# Altium project jetson-tx-baseboard.PrjPcb (part 1 of 2)
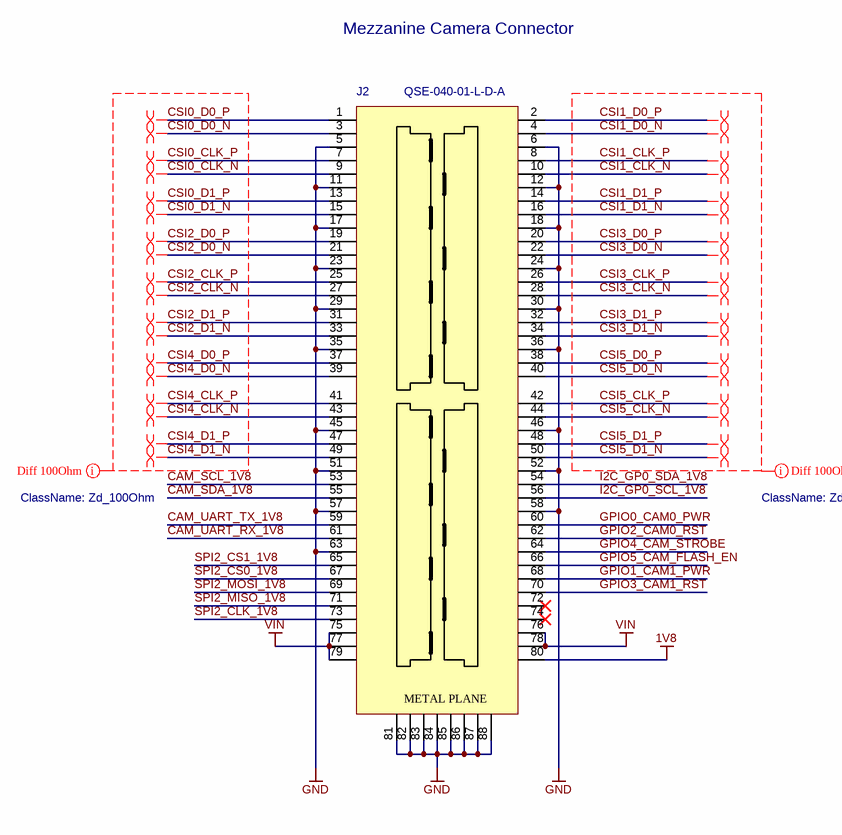
[diagram p0: Camera.SchDoc]
AM_Revision: 2.2.1; AM_Status: OSHW; AM_Title: TX Baseboard
10 sheets, 214 parts. Net scope: global (net labels, ports and power ports of the same name join across sheets).
Board file: PCB.PcbDoc
Sheets:
  Camera.SchDoc
  Ethernet.SchDoc
  HDMI.SchDoc
  ID-Serial.SchDoc
  Misc.SchDoc
  SoM-Interfaces.SchDoc
  SoM-Unused.SchDoc
  Supply.SchDoc
  UART.SchDoc
  USB.SchDoc

## Sheet Camera.SchDoc
size A3; DocumentNumber: 8; SheetNumber: 8; SheetTotal: 10; PageSetup: Record=PageOptions|CenterHorizontal=True|CenterVertical=True|PrintScale=0.97|XCorrection=1.00|YCorrection=1.00|PrintKind=1|BorderSize=5000000|LeftOffset=0|BottomOffset=0|Orientation=2|PaperLength=2970|PaperWidth=2100|Scale=100|PaperSource=7|PrintQuality=600|MediaType=1|DitherType=10|PaperKind=A4|PrintScaleMode=1

### Parts
J2  QSE-040-01-L-D-A  [QSE-040-01-L-D-A]

### Nets
1V8: J2.80
GND: J2.5 J2.6 J2.11 J2.12 J2.17 J2.18 J2.23 J2.24 J2.29 J2.30 J2.35 J2.36 J2.45 J2.46 J2.51 J2.52 J2.57 J2.58 J2.63 J2.81 J2.82 J2.83 J2.84 J2.85 J2.86 J2.87 J2.88
VIN: J2.75 J2.76 J2.77 J2.78 J2.79
CAM_SCL_1V8: J2.53
CAM_SDA_1V8: J2.55
CAM_UART_RX_1V8: J2.61
CAM_UART_TX_1V8: J2.59
CSI0_CLK_N: J2.9
CSI0_CLK_P: J2.7
CSI0_D0_N: J2.3
CSI0_D0_P: J2.1
CSI0_D1_N: J2.15
CSI0_D1_P: J2.13
CSI1_CLK_N: J2.10
CSI1_CLK_P: J2.8
CSI1_D0_N: J2.4
CSI1_D0_P: J2.2
CSI1_D1_N: J2.16
CSI1_D1_P: J2.14
CSI2_CLK_N: J2.27
CSI2_CLK_P: J2.25
CSI2_D0_N: J2.21
CSI2_D0_P: J2.19
CSI2_D1_N: J2.33
CSI2_D1_P: J2.31
CSI3_CLK_N: J2.28
CSI3_CLK_P: J2.26
CSI3_D0_N: J2.22
CSI3_D0_P: J2.20
CSI3_D1_N: J2.34
CSI3_D1_P: J2.32
CSI4_CLK_N: J2.43
CSI4_CLK_P: J2.41
CSI4_D0_N: J2.39
CSI4_D0_P: J2.37
CSI4_D1_N: J2.49
CSI4_D1_P: J2.47
CSI5_CLK_N: J2.44
CSI5_CLK_P: J2.42
CSI5_D0_N: J2.40
CSI5_D0_P: J2.38
CSI5_D1_N: J2.50
CSI5_D1_P: J2.48
GPIO0_CAM0_PWR: J2.60
GPIO1_CAM1_PWR: J2.68
GPIO2_CAM0_RST: J2.62
GPIO3_CAM1_RST: J2.70
GPIO4_CAM_STROBE: J2.64
GPIO5_CAM_FLASH_EN: J2.66
I2C_GP0_SCL_1V8: J2.56
I2C_GP0_SDA_1V8: J2.54
SPI2_CLK_1V8: J2.73
SPI2_CS0_1V8: J2.67
SPI2_CS1_1V8: J2.65
SPI2_MISO_1V8: J2.71
SPI2_MOSI_1V8: J2.69

Not connected (* = marked no-connect by the designer): J2 72* 74*

### Layout directives
differential pair: CSI0_CLK_N, CSI0_CLK_P, CSI0_D0_N, CSI0_D0_P, CSI0_D1_N, CSI0_D1_P, CSI1_CLK_N, CSI1_CLK_P, CSI1_D0_N, CSI1_D0_P, CSI1_D1_N, CSI1_D1_P, CSI2_CLK_N, CSI2_CLK_P, CSI2_D0_N, CSI2_D0_P, CSI2_D1_N, CSI2_D1_P, CSI3_CLK_N, CSI3_CLK_P, CSI3_D0_N, CSI3_D0_P, CSI3_D1_N, CSI3_D1_P, CSI4_CLK_N, CSI4_CLK_P, CSI4_D0_N, CSI4_D0_P, CSI4_D1_N, CSI4_D1_P, CSI5_CLK_N, CSI5_CLK_P, CSI5_D0_N, CSI5_D0_P, CSI5_D1_N, CSI5_D1_P
net class Zd_100Ohm: CSI0_CLK_N, CSI0_CLK_P, CSI0_D0_N, CSI0_D0_P, CSI0_D1_N, CSI0_D1_P, CSI1_CLK_N, CSI1_CLK_P, CSI1_D0_N, CSI1_D0_P, CSI1_D1_N, CSI1_D1_P, CSI2_CLK_N, CSI2_CLK_P, CSI2_D0_N, CSI2_D0_P, CSI2_D1_N, CSI2_D1_P, CSI3_CLK_N, CSI3_CLK_P, CSI3_D0_N, CSI3_D0_P, CSI3_D1_N, CSI3_D1_P, CSI4_CLK_N, CSI4_CLK_P, CSI4_D0_N, CSI4_D0_P, CSI4_D1_N, CSI4_D1_P, CSI5_CLK_N, CSI5_CLK_P, CSI5_D0_N, CSI5_D0_P, CSI5_D1_N, CSI5_D1_P

### Notes on the sheet
- Mezzanine Camera Connector
- Title:
- Size:
- Date:
- A3
- Revision:
- Page:
- of
- Antmicro Ltd.
- File:
- www.antmicro.com
- (in symbol QSE-040-01-L-D-A) METAL PLANE

### Library data of the parts
J2 = QSE-040-01-L-D-A: SAMTEC 	QSE-040-01-L-D-A  Stacking Board Connector, Dual Row, QSE Series, Receptacle, 0.8 mm, 80 Contacts, Surface Mount; Part Number: QSE-040-01-L-D-A; Value: QSE-040-01-L-D-A; Manufacturer: SAMTEC; Part Symbol: QSE-040-01-L-D-A

## Sheet Ethernet.SchDoc
size A3; DocumentNumber: 7; SheetNumber: 7; SheetTotal: 10; PageSetup: Record=PageOptions|CenterHorizontal=True|CenterVertical=True|PrintScale=0.97|XCorrection=1.00|YCorrection=1.00|PrintKind=1|BorderSize=5000000|LeftOffset=0|BottomOffset=0|Orientation=2|PaperLength=2970|PaperWidth=2100|Scale=100|PaperSource=7|PrintQuality=600|MediaType=1|DitherType=10|PaperKind=A4|PrintScaleMode=1
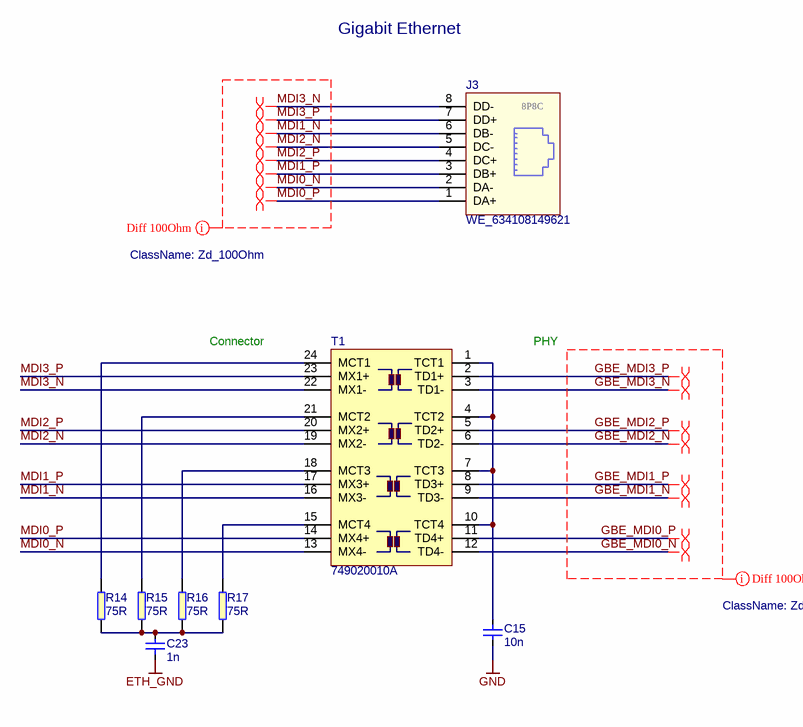
[diagram p1: Ethernet.SchDoc]

### Parts
C15  10n  [1206]
C23  1n  [1206]
J3  WE_634108149621  [WE_634108149621]
R14  75R  [0603]
R15  75R  [0603]
R16  75R  [0603]
R17  75R  [0603]
T1  749020010A  [Wurth-749020010A]

### Nets
ETH_GND: C23.1
GND: C15.2
GBE_MDI0_N: T1.12(TD4-)
GBE_MDI0_P: T1.11(TD4+)
GBE_MDI1_N: T1.9(TD3-)
GBE_MDI1_P: T1.8(TD3+)
GBE_MDI2_N: T1.6(TD2-)
GBE_MDI2_P: T1.5(TD2+)
GBE_MDI3_N: T1.3(TD1-)
GBE_MDI3_P: T1.2(TD1+)
MDI0_N: J3.2(DA-) T1.13(MX4-)
MDI0_P: J3.1(DA+) T1.14(MX4+)
MDI1_N: J3.6(DB-) T1.16(MX3-)
MDI1_P: J3.3(DB+) T1.17(MX3+)
MDI2_N: J3.5(DC-) T1.19(MX2-)
MDI2_P: J3.4(DC+) T1.20(MX2+)
MDI3_N: J3.8(DD-) T1.22(MX1-)
MDI3_P: J3.7(DD+) T1.23(MX1+)
NetC15_1: C15.1 T1.1(TCT1) T1.4(TCT2) T1.7(TCT3) T1.10(TCT4)
NetC23_2: C23.2 R14.1 R15.1 R16.1 R17.1
NetR14_2: R14.2 T1.24(MCT1)
NetR15_2: R15.2 T1.21(MCT2)
NetR16_2: R16.2 T1.18(MCT3)
NetR17_2: R17.2 T1.15(MCT4)

### Layout directives
differential pair: GBE_MDI0_N, GBE_MDI0_P, GBE_MDI1_N, GBE_MDI1_P, GBE_MDI2_N, GBE_MDI2_P, GBE_MDI3_N, GBE_MDI3_P, MDI0_N, MDI0_P, MDI1_N, MDI1_P, MDI2_N, MDI2_P, MDI3_N, MDI3_P
net class Zd_100Ohm: GBE_MDI0_N, GBE_MDI0_P, GBE_MDI1_N, GBE_MDI1_P, GBE_MDI2_N, GBE_MDI2_P, GBE_MDI3_N, GBE_MDI3_P, MDI0_N, MDI0_P, MDI1_N, MDI1_P, MDI2_N, MDI2_P, MDI3_N, MDI3_P

### Notes on the sheet
- Gigabit Ethernet
- Connector
- PHY
- Title:
- Size:
- Date:
- A3
- Revision:
- Page:
- of
- Antmicro Ltd.
- File:
- www.antmicro.com
- (in symbol WE_634108149621) 8P8C

### Library data of the parts
C15 = C_10n_1206: MLCC SMT Capacitor 10nF 1206; Manufacturer: MULTICOMP; Part Symbol: MC1206B103K631CT; Value: 10n; Part Number: C_10n_1206
C23 = C_1n_1206: MLCC SMT Capacitor 1nF 1206; Manufacturer: AVX; Part Symbol: 12061A102JAT2A; Value: 1n; Part Number: C_1n_1206
J3 = WE_634108149621: Modular Connectors / Ethernet Connectors WR-MJ Mod Jk 8P8C Solder Tab w/Mylar; Manufacturer: WURTH ELEKTRONIK; Part Number: WE_634108149621; Value: WE_634108149621; Part Symbol: 634108149621
R14-R17 = R_75R_0603: SMT Resistor 75R 0603; Manufacturer: MULTICOMP; Part Symbol: MCWR06X75R0FTL; Value: 75R; Part Number: R_75R_0603
T1 = Wurth-749020010A: LAN TRANSFORMER, 10/100/1000 BASE-T; Manufacturer: WURTH ELEKTRONIK; Part Number: Wurth-749020010A; Value: 749020010A; Part Symbol: 749020010A

## Sheet HDMI.SchDoc
size A3; DocumentNumber: 6; SheetNumber: 6; SheetTotal: 10; PageSetup: Record=PageOptions|CenterHorizontal=True|CenterVertical=True|PrintScale=0.97|XCorrection=1.00|YCorrection=1.00|PrintKind=1|BorderSize=5000000|LeftOffset=0|BottomOffset=0|Orientation=2|PaperLength=2970|PaperWidth=2100|Scale=100|PaperSource=7|PrintQuality=600|MediaType=1|DitherType=10|PaperKind=A4|PrintScaleMode=1
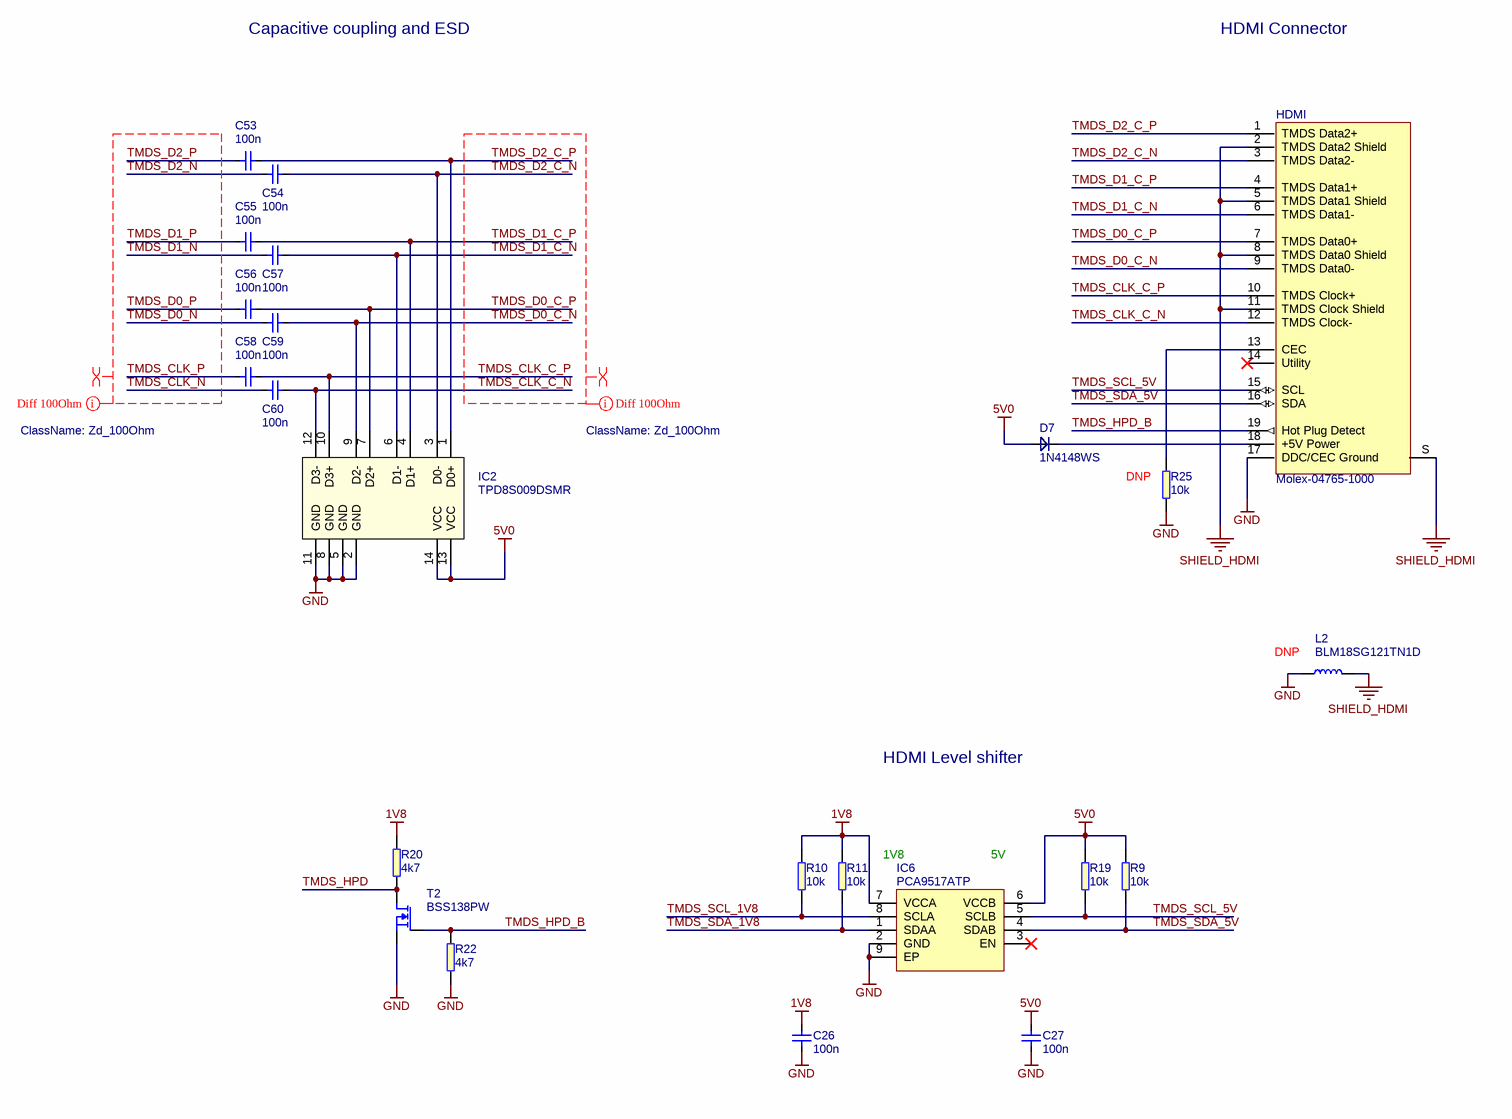
[diagram p2: HDMI.SchDoc]

### Parts
C26  100n  [0603]
C27  100n  [0603]
C53  100n  [0402]
C54  100n  [0402]
C55  100n  [0402]
C56  100n  [0402]
C57  100n  [0402]
C58  100n  [0402]
C59  100n  [0402]
C60  100n  [0402]
D7  1N4148WS  [SOD-323]
HDMI  Molex-04765-1000  [CON-Molex-04765-1000]
IC2  Part Symbol: TPD8S009DSMR  [SON-15]  (hidden comment: TPD8S009)
IC6  PCA9517ATP  [PCA9517ATP]
L2  BLM18SG121TN1D  [0603]
R9  10k  [0603]
R10  10k  [0603]
R11  10k  [0603]
R19  10k  [0603]
R20  4k7  [0603]
R22  4k7  [0603]
R25  10k  [0402]
T2  BSS138PW  [SC70-3]

### Nets
1V8: C26.2 IC6.7(VCCA) R10.2 R11.2 R20.2
5V0: C27.2 D7.A IC2.13(VCC) IC2.14(VCC) IC6.6(VCCB) R9.2 R19.2
GND: C26.1 C27.1 HDMI.17(DDC/CEC_Ground) IC2.2(GND) IC2.5(GND) IC2.8(GND) IC2.11(GND) IC6.2(GND) IC6.9(EP) L2.1 R22.1 R25.1 T2.2(S)
SHIELD_HDMI: HDMI.2(TMDS_Data2_Shield) HDMI.5(TMDS_Data1_Shield) HDMI.8(TMDS_Data0_Shield) HDMI.11(TMDS_Clock_Shield) HDMI.S(SH) L2.2
TMDS_CLK_C_N: C60.2 HDMI.12(TMDS_Clock-) IC2.12(D3-)
TMDS_CLK_C_P: C58.2 HDMI.10(TMDS_Clock+) IC2.10(D3+)
TMDS_CLK_N: C60.1
TMDS_CLK_P: C58.1
TMDS_D0_C_N: C59.2 HDMI.9(TMDS_Data0-) IC2.9(D2-)
TMDS_D0_C_P: C56.2 HDMI.7(TMDS_Data0+) IC2.7(D2+)
TMDS_D0_N: C59.1
TMDS_D0_P: C56.1
TMDS_D1_C_N: C57.2 HDMI.6(TMDS_Data1-) IC2.6(D1-)
TMDS_D1_C_P: C55.2 HDMI.4(TMDS_Data1+) IC2.4(D1+)
TMDS_D1_N: C57.1
TMDS_D1_P: C55.1
TMDS_D2_C_N: C54.2 HDMI.3(TMDS_Data2-) IC2.3(D0-)
TMDS_D2_C_P: C53.2 HDMI.1(TMDS_Data2+) IC2.1(D0+)
TMDS_D2_N: C54.1
TMDS_D2_P: C53.1
TMDS_HPD: R20.1 T2.3(D)
TMDS_HPD_B: HDMI.19(Hot_Plug_Detect) R22.2 T2.1(G)
TMDS_SCL_1V8: IC6.8(SCLA) R10.1
TMDS_SCL_5V: HDMI.15(SCL) IC6.5(SCLB) R19.1
TMDS_SDA_1V8: IC6.1(SDAA) R11.1
TMDS_SDA_5V: HDMI.16(SDA) IC6.4(SDAB) R9.1
NetD7_C: D7.C HDMI.18(+5V_Power)
NetHDMI_13: HDMI.13(CEC) R25.2

Not connected (* = marked no-connect by the designer): HDMI 14(Utility)*; IC6 3(EN)*

### Layout directives
net class Zd_100Ohm: TMDS_CLK_C_N, TMDS_CLK_C_P, TMDS_CLK_N, TMDS_CLK_P, TMDS_D0_C_N, TMDS_D0_C_P, TMDS_D0_N, TMDS_D0_P, TMDS_D1_C_N, TMDS_D1_C_P, TMDS_D1_N, TMDS_D1_P, TMDS_D2_C_N, TMDS_D2_C_P, TMDS_D2_N, TMDS_D2_P
differential pair: TMDS_CLK_C_N, TMDS_CLK_C_P, TMDS_CLK_N, TMDS_CLK_P, TMDS_D0_C_N, TMDS_D0_C_P, TMDS_D0_N, TMDS_D0_P, TMDS_D1_C_N, TMDS_D1_C_P, TMDS_D1_N, TMDS_D1_P, TMDS_D2_C_N, TMDS_D2_C_P, TMDS_D2_N, TMDS_D2_P

### Notes on the sheet
- Capacitive coupling and ESD
- HDMI Connector
- (near R25) DNP
- (near L2) DNP
- HDMI Level shifter
- 1V8
- (near IC6) 5V
- Title:
- Size:
- Date:
- A3
- Revision:
- Page:
- of
- Antmicro Ltd.
- File:
- www.antmicro.com

### Library data of the parts
C26 C27 = C_100n_0603: MLCC SMT Capacitor 100nF 0603; Manufacturer: WALSIN; Part Symbol: 0603B104K500CT; Part Number: C_100n_0603; Value: 100n
C53-C60 = C_100n_0402: MLCC SMT Capacitor 100nF 0402; Manufacturer: MULTICOMP; Part Symbol: MC0402X104M100CT; Part Number: C_100n_0402; Value: 100n
D7 = 1N4148WS: Diode small signal; Manufacturer: MULTICOMP; Part Number: 1N4148WS; Value: 1N4148WS; Part Symbol: 1N4148WS
HDMI = CON-Molex-47659-1000: HDMI connector vertical; Manufacturer: Molex; Part Number: CON-Molex-47659-1000; Value: Molex-04765-1000; Part Symbol: 47659-1000
IC2 = TPD8S009: 8-Channel ESD Protection for DisplayPort and HDMI; Manufacturer: TEXAS INSTRUMENTS; Part Number: TPD8S009; Value: TPD8S009
IC6 = PCA9517ATP: I2C BUS REPEATER W/ LEVEL TRANS, HWSON-8; Manufacturer: NXP; Part Number: PCA9517ATP; Value: PCA9517ATP; Part Symbol: PCA9517ATP
L2 = BLM18SG121TN1D: FERRITE BEAD, 0.025OHM, 3A, 0603; Manufacturer: MURATA; Part Number: BLM18SG121TN1D; Value: BLM18SG121TN1D; Part Symbol: BLM18SG121TN1D
R9-R11 R19 = R_10k_0603: SMT Resistor 10k 0603; Manufacturer: BOURNS; Part Symbol: CR0603-JW-103ELF; Part Number: R_10k_0603; Value: 10k
R20 R22 = R_4k7_0603: SMT Resistor 4k7 0603; Manufacturer: BOURNS; Part Symbol: CR0603-FX-4701ELF; Part Number: R_4k7_0603; Value: 4k7
R25 = R_10k_0402: SMT Resistor 0402; Manufacturer: MULTICOMP; Part Symbol: MCMR04X1002FTL; Part Number: R_10k_0402; Value: 10k
T2 = BSS138PW: MOSFET, N CH, 60V, 0.2A; Manufacturer: NXP; Value: BSS138PW; Part Number: BSS138PW; Part Symbol: BSS138PW

## Sheet ID-Serial.SchDoc
size A3; DocumentNumber: 10; SheetNumber: 10; SheetTotal: 10; PageSetup: Record=PageOptions|CenterHorizontal=True|CenterVertical=True|PrintScale=0.97|XCorrection=1.00|YCorrection=1.00|PrintKind=1|BorderSize=5000000|LeftOffset=0|BottomOffset=0|Orientation=2|PaperLength=2970|PaperWidth=2100|Scale=100|PaperSource=7|PrintQuality=600|MediaType=1|DitherType=10|PaperKind=A4|PrintScaleMode=1
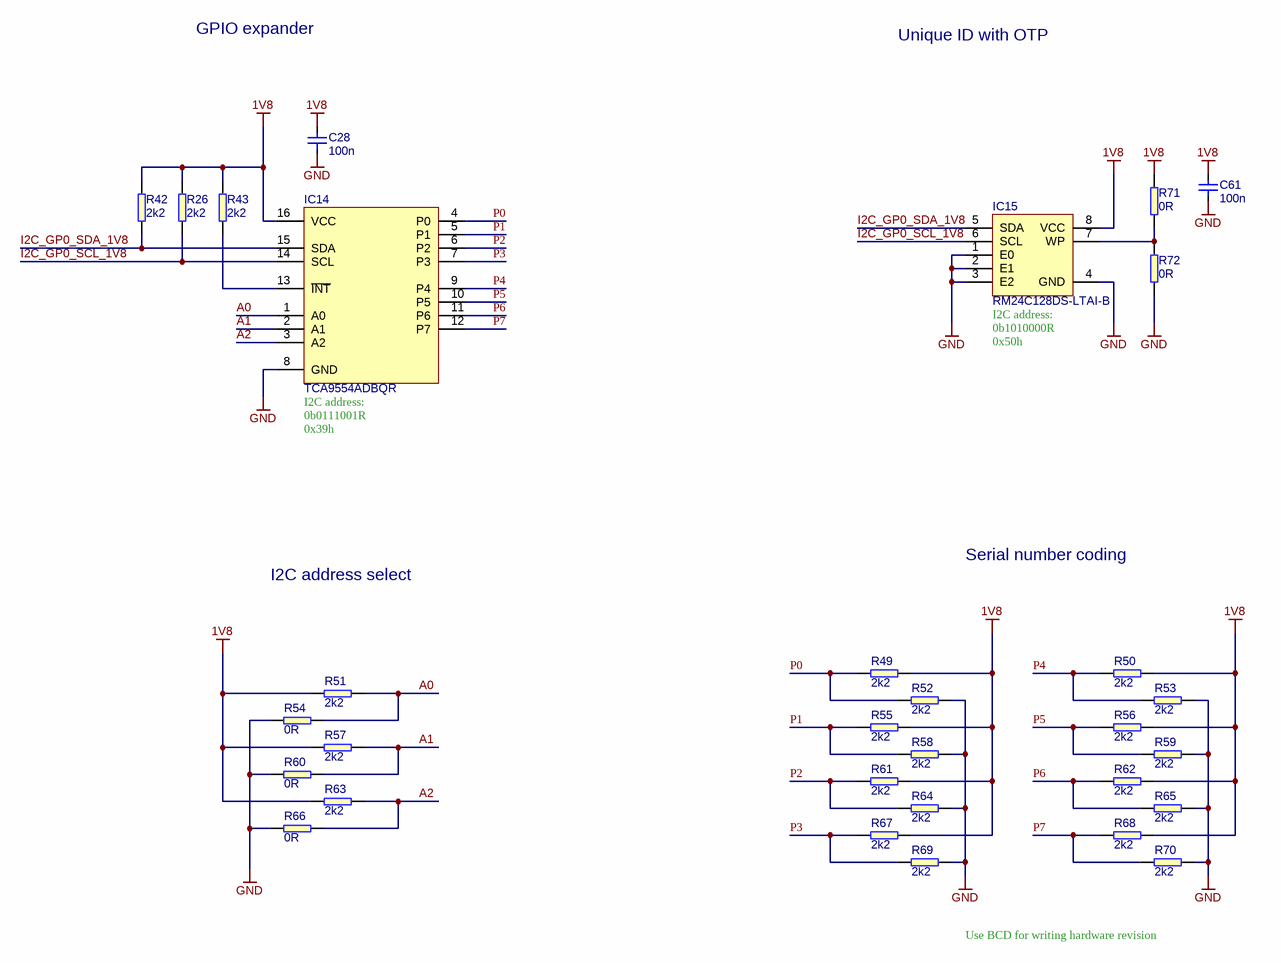
[diagram p3: ID-Serial.SchDoc]

### Parts
C28  100n  [0603]
C61  100n  [0603]
IC14  TCA9554ADBQR  [DBQ0016A]
IC15  RM24C128DS-LTAI-B  [TSSOP-8]
R26  2k2  [0603]
R42  2k2  [0603]
R43  2k2  [0603]
R49  2k2  [0402]
R50  2k2  [0402]
R51  2k2  [0402]
R52  2k2  [0402]
R53  2k2  [0402]
R54  0R  [0402]
R55  2k2  [0402]
R56  2k2  [0402]
R57  2k2  [0402]
R58  2k2  [0402]
R59  2k2  [0402]
R60  0R  [0402]
R61  2k2  [0402]
R62  2k2  [0402]
R63  2k2  [0402]
R64  2k2  [0402]
R65  2k2  [0402]
R66  0R  [0402]
R67  2k2  [0402]
R68  2k2  [0402]
R69  2k2  [0402]
R70  2k2  [0402]
R71  0R  [0603]
R72  0R  [0603]

### Nets
1V8: C28.2 C61.2 IC14.16(VCC) IC15.8(VCC) R26.2 R42.2 R43.2 R49.2 R50.2 R51.1 R55.2 R56.2 R57.1 R61.2 R62.2 R63.1 R67.2 R68.2 R71.2
GND: C28.1 C61.1 IC14.8(GND) IC15.1(E0) IC15.2(E1) IC15.3(E2) IC15.4(GND) R52.2 R53.2 R54.1 R58.2 R59.2 R60.1 R64.2 R65.2 R66.1 R69.2 R70.2 R72.1
A0: IC14.1(A0) R51.2 R54.2
A1: IC14.2(A1) R57.2 R60.2
A2: IC14.3(A2) R63.2 R66.2
I2C_GP0_SCL_1V8: IC14.14(SCL) IC15.6(SCL) R26.1
I2C_GP0_SDA_1V8: IC14.15(SDA) IC15.5(SDA) R42.1
P0: IC14.4(P0) R49.1 R52.1
P1: IC14.5(P1) R55.1 R58.1
P2: IC14.6(P2) R61.1 R64.1
P3: IC14.7(P3) R67.1 R69.1
P4: IC14.9(P4) R50.1 R53.1
P5: IC14.10(P5) R56.1 R59.1
P6: IC14.11(P6) R62.1 R65.1
P7: IC14.12(P7) R68.1 R70.1
NetIC14_13: IC14.13(~{INT}) R43.1
NetIC15_7: IC15.7(WP) R71.1 R72.2

### Notes on the sheet
- GPIO expander
- Unique ID with OTP
- (near IC15) 0b1010000R
- 0x50h
- (near IC15) I2C address:
- (near IC14) 0b0111001R
- 0x39h
- (near IC14) I2C address:
- Serial number coding
- I2C address select
- Use BCD for writing hardware revision
- Title:
- Size:
- Date:
- A3
- Revision:
- Page:
- of
- Antmicro Ltd.
- File:
- www.antmicro.com

### Library data of the parts
C28 C61 = C_100n_0603: as C26 on sheet HDMI; Part Number: C_100n_0603; Value: 100n
IC14 = TCA9554A: Remote 8bit I2C SMBus I/O expander; Manufacturer: Texas Instruments; Part Number: TCA9554ADBQR; Value: TCA9554ADBQR; Part Symbol: TCA9554ADBQR
IC15 = RM24C128DS: EEPROM with UID and OTP registers.; Manufacturer: Adesto; Part Number: RM24C128DS; Value: RM24C128DS-LTAI-B; Part Symbol: RM24C128DS-LTAI-B
R26 R42 R43 = R_2k2_0603: SMT Resistor 2k2 0603; Manufacturer: MULTICOMP; Part Symbol: MCMR06X2201FTL; Part Number: R_2k2_0603; Value: 2k2
R49-R53 R55-R59 R61-R65 R67-R70 = R_2k2_0402: RES, 2k2, 0402, 5%; Manufacturer: MULTICOMP; Part Symbol: MCWR04X2201FTL; Part Number: R_2k2_0402; Value: 2k2
R54 R60 R66 = R_0R_0402: SMT Resistor 0402; Manufacturer: MULTICOMP; Part Symbol: MCMR04X000 PTL; Part Number: R_0R_0402; Value: 0R
R71 R72 = R_0R_0603: SMT Resistor 0R 0603; Manufacturer: BOURNS; Part Symbol: CR0603-J/-000ELF; Part Number: R_0R_0603; Value: 0R

## Sheet Misc.SchDoc
size A3; DocumentNumber: 9; SheetNumber: 9; SheetTotal: 10; PageSetup: Record=PageOptions|CenterHorizontal=True|CenterVertical=True|PrintScale=0.97|XCorrection=1.00|YCorrection=1.00|PrintKind=1|BorderSize=5000000|LeftOffset=0|BottomOffset=0|Orientation=2|PaperLength=2970|PaperWidth=2100|Scale=100|PaperSource=7|PrintQuality=600|MediaType=1|DitherType=10|PaperKind=A4|PrintScaleMode=1
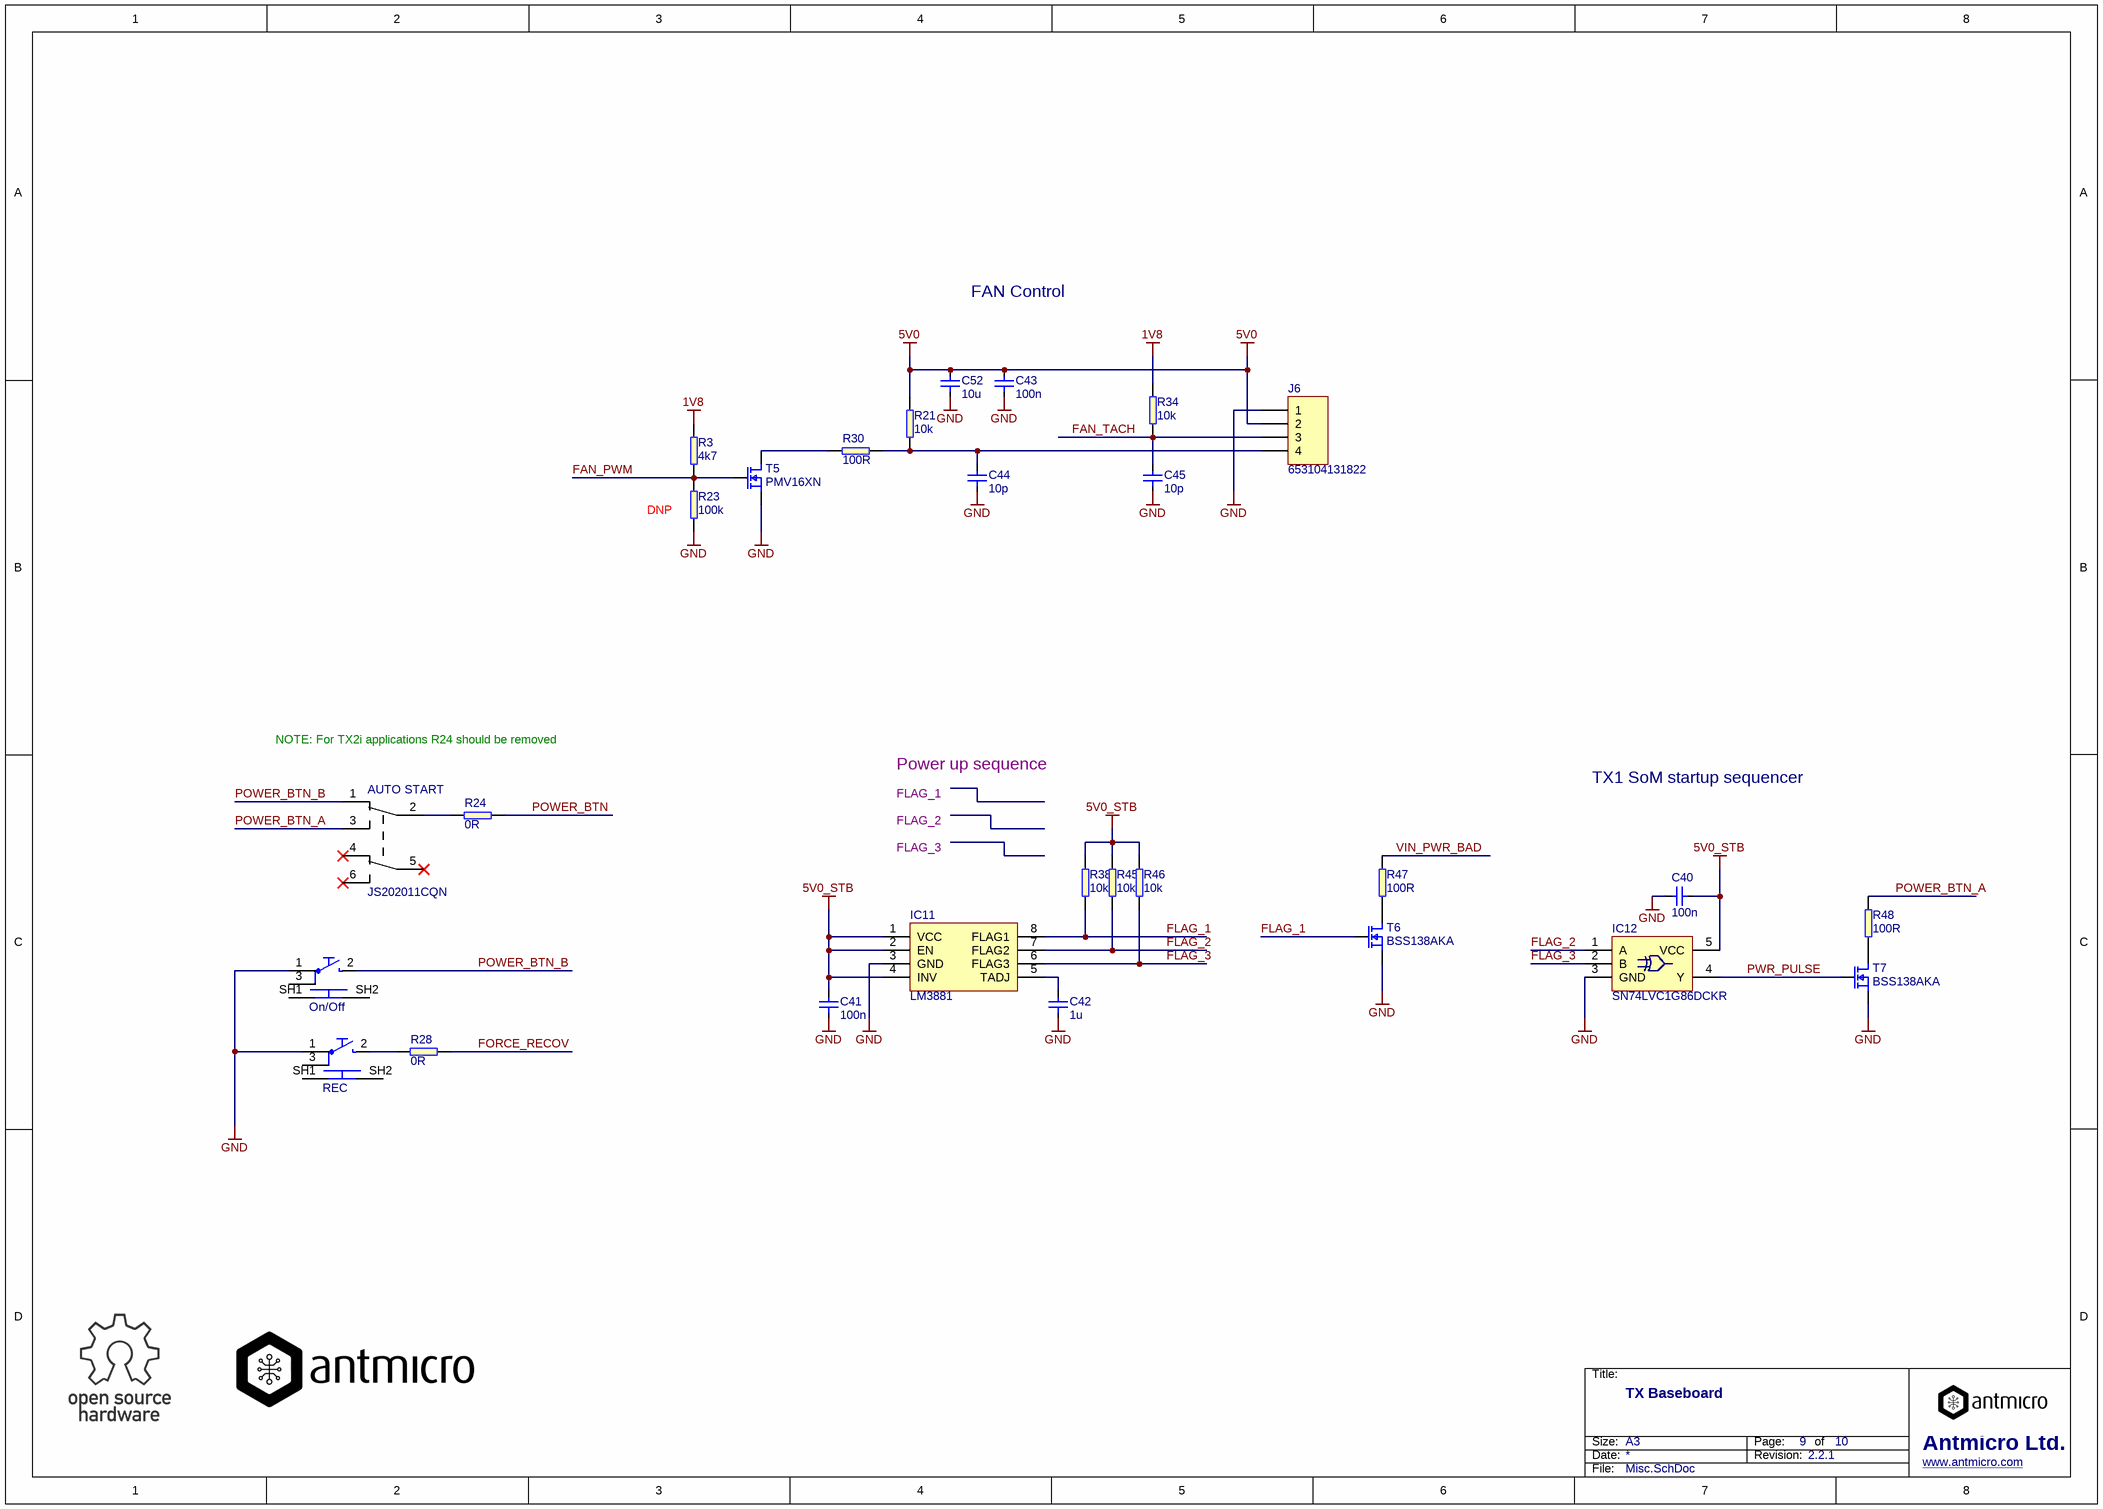
[diagram p4: Misc.SchDoc]

### Parts
AUTO_START  JS202011CQN  [JS202011CQN]
C40  100n  [0603]
C41  100n  [0603]
C42  1u  [0603]
C43  100n  [0603]
C44  10p  [0603]
C45  10p  [0603]
C52  10u  [0603]
IC11  LM3881  [MSOP-8]
IC12  SN74LVC1G86DCKR  [SC70-5]
J6  653104131822  [WE_653104131822]
On/Off  TL3340AF160QG  [TL3340AF160QG]  (value not drawn)
R3  4k7  [0603]
R21  10k  [0603]
R23  100k  [0603]
R24  0R  [0603]
R28  0R  [0603]
R30  100R  [0603]
R34  10k  [0603]
R38  10k  [0603]
R45  10k  [0603]
R46  10k  [0603]
R47  100R  [0603]
R48  100R  [0603]
REC  TL3340AF160QG  [TL3340AF160QG]  (value not drawn)
T5  PMV16XN  [SOT-23]
T6  BSS138AKA  [SOT-23]
T7  BSS138AKA  [SOT-23]

### Nets
1V8: R3.2 R34.2
5V0: C43.2 C52.2 J6.2 R21.2
5V0_STB: C40.1 C41.2 IC11.1(VCC) IC11.2(EN) IC11.4(INV) IC12.5(VCC) R38.2 R45.2 R46.2
GND: C40.2 C41.1 C42.1 C43.1 C44.1 C45.1 C52.1 IC11.3(GND) IC12.3(GND) J6.1 On/Off.1 R23.1 REC.1 T5.2(S) T6.2(S) T7.2(S)
FAN_PWM: R3.1 R23.2 T5.1(G)
FAN_TACH: C45.2 J6.3 R34.1
FLAG_1: IC11.8(FLAG1) R38.1 T6.1(G)
FLAG_2: IC11.7(FLAG2) IC12.1(A) R45.1
FLAG_3: IC11.6(FLAG3) IC12.2(B) R46.1
FORCE_RECOV: R28.2
POWER_BTN: R24.2
POWER_BTN_A: AUTO_START.3 R48.2
POWER_BTN_B: AUTO_START.1 On/Off.2
PWR_PULSE: IC12.4(Y) T7.1(G)
VIN_PWR_BAD: R47.2
NetAUTO_START_2: AUTO_START.2 R24.1
NetC42_2: C42.2 IC11.5(TADJ)
NetC44_2: C44.2 J6.4 R21.1 R30.2
NetR28_1: R28.1 REC.2
NetR30_1: R30.1 T5.3(D)
NetR47_1: R47.1 T6.3(D)
NetR48_1: R48.1 T7.3(D)

Not connected (* = marked no-connect by the designer): AUTO_START 4* 5* 6*; On/Off 3 SH1 SH2; REC 3 SH1 SH2

### Notes on the sheet
- FAN Control
- (near R23) DNP
- NOTE: For TX2i applications R24 should be removed
- Power up sequence
- TX1 SoM startup sequencer
- FLAG_1
- FLAG_2
- FLAG_3
- Title:
- Size:
- Date:
- A3
- Revision:
- Page:
- of
- Antmicro Ltd.
- File:
- www.antmicro.com

### Library data of the parts
AUTO_START = DPDT: Sub-Miniature Slide Switch; Manufacturer: C&K; Value: JS202011CQN; Part Symbol: JS202011CQN
C40 C41 C43 = C_100n_0603: as C26 on sheet HDMI; Part Number: C_100n_0603; Value: 100n
C42 = C_1u_0603: MLCC SMT Capacitor 1uF 0603; Manufacturer: MULTICOMP; Part Symbol: MC0603X105M6R3CT; Part Number: C_1u_0603; Value: 1u
C44 C45 = C_10p_0603: MLCC SMT Capacitor 10pF 0603; Manufacturer: JOHANSON TECHNOLOGY; Part Symbol: 251R14S100GV4T; Value: 10p; Part Number: C_10p_0603
C52 = C_10u_0603: MLCC SMT Capacitor 10uF 0603; Manufacturer: MULTICOMP; Part Symbol: MC0603X106M6R3CT; Value: 10u; Part Number: C_10u_0603
IC11 = LM3881: TEXAS INSTRUMENTS  LM3881MME/NOPB  Power Sequencer, 3-Monitors, 2.7V-5.5Vin,VSSOP-8; Part Number: LM3881; Value: LM3881; Manufacturer: TEXAS INSTRUMENTS; Part Symbol: LM3881MME
IC12 = SN74LVC1G86: 2 input XOR gate; Manufacturer: Texas Instruments; Part Number: SN74LVC1G86DCKR; Value: SN74LVC1G86DCKR; Part Symbol: SN74LVC1G86DCKR
J6 = WE_653104131822: HEADER 4POS MALE HORIZ 1.25MM SMD; Manufacturer: WURTH ELEKTRONIK; Part Number: WE_653104131822; Value: 653104131822; Part Symbol: 653104131822
On/Off REC = TL3340AF160QG: E-SWITCH  TL3340AF160QG  SWITCH, TACTILE SPST 50mA, SMD GULL WING; Part Number: TL3340AF160QG; Value: TL3340AF160QG; Manufacturer: E-SWITCH; Part Symbol: TL3340AF160QG
R3 = R_4k7_0603: as R20 on sheet HDMI; Value: 4k7; Part Number: R_4k7_0603
R21 R34 R38 R45 R46 = R_10k_0603: as R9 on sheet HDMI; Value: 10k; Part Number: R_10k_0603
R23 = R_100k_0603: SMT Resistor 100k 0603; Manufacturer: BOURNS; Part Symbol: CR0603-JW-104GLF; Value: 100k; Part Number: R_100k_0603
R24 R28 = R_0R_0603: as R71 on sheet ID-Serial; Value: 0R; Part Number: R_0R_0603
R30 R47 R48 = R_100R_0603: SMT Resistor 100R 0603; Manufacturer: MULTICOMP; Part Symbol: MC0063W06035100R; Value: 100R; Part Number: R_100R_0603
T5 = PMV16XN: MOSFET Transistor, N Channel, 6.8 A, 20 V, 0.016 ohm, 4.5 V; Manufacturer: NXP; Value: PMV16XN; Part Number: PMV16XN; Part Symbol: PMV16XN
T6 T7 = BSS138: MOSFET, N CH, 60V, 0.2A; Part Number: BSS138; Manufacturer: NXP; Value: BSS138AKA; Part Symbol: BSS138AKA

## Sheet SoM-Interfaces.SchDoc
size A3; DocumentNumber: 1; SheetNumber: 1; SheetTotal: 10; PageSetup: Record=PageOptions|CenterHorizontal=True|CenterVertical=True|PrintScale=0.97|XCorrection=1.00|YCorrection=1.00|PrintKind=1|BorderSize=5000000|LeftOffset=0|BottomOffset=0|Orientation=2|PaperLength=2970|PaperWidth=2100|Scale=100|PaperSource=7|PrintQuality=600|MediaType=1|DitherType=10|PaperKind=A4|PrintScaleMode=1
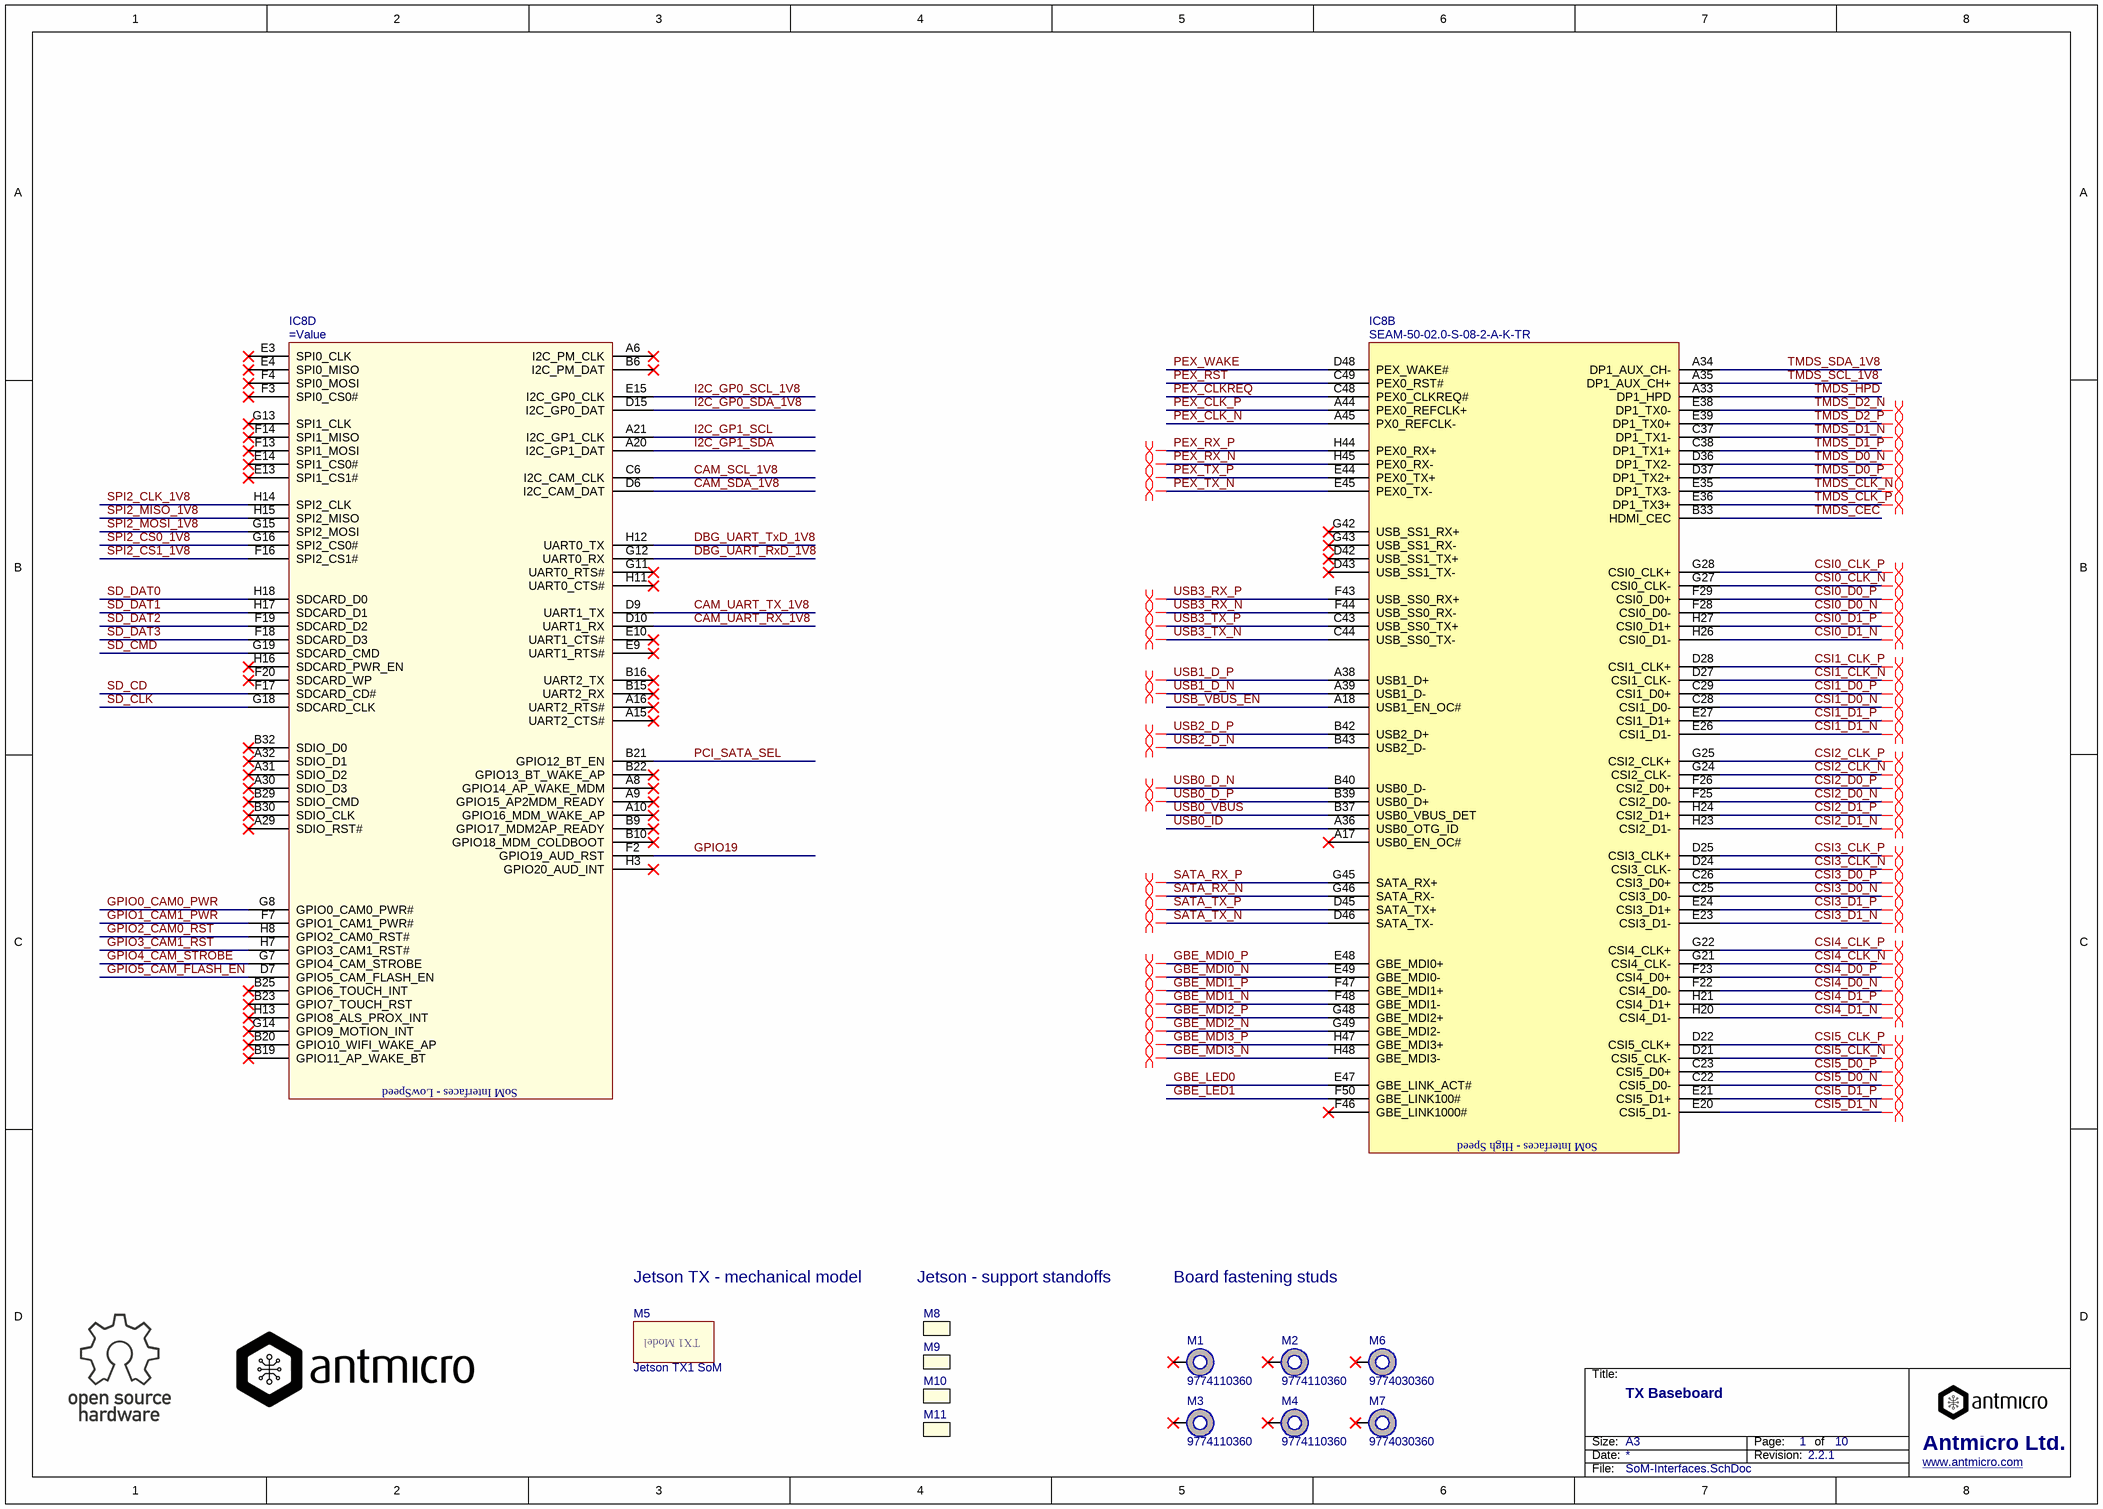
[diagram p5: SoM-Interfaces.SchDoc]

### Parts
IC8  SEAM-50-02.0-S-08-2-A-K-TR  [Nvidia-TX1-SoM]  (parts B,D of 4)
M1  9774110360  [WE_9774110360]
M2  9774110360  [WE_9774110360]
M3  9774110360  [WE_9774110360]
M4  9774110360  [WE_9774110360]
M5  Jetson TX1 SoM  [Nvidia-TX1-Model]
M6  9774030360  [M3-3mm]
M7  9774030360  [M3-3mm]
M8  GENERIC_BOM_ONLY  (value not drawn)  (mechanical)
M9  GENERIC_BOM_ONLY  (value not drawn)  (mechanical)
M10  GENERIC_BOM_ONLY  (value not drawn)  (mechanical)
M11  GENERIC_BOM_ONLY  (value not drawn)  (mechanical)

### Nets
CAM_SCL_1V8: IC8.C6(I2C_CAM_CLK)
CAM_SDA_1V8: IC8.D6(I2C_CAM_DAT)
CAM_UART_RX_1V8: IC8.D10(UART1_RX)
CAM_UART_TX_1V8: IC8.D9(UART1_TX)
CSI0_CLK_N: IC8.G27(CSI0_CLK-)
CSI0_CLK_P: IC8.G28(CSI0_CLK+)
CSI0_D0_N: IC8.F28(CSI0_D0-)
CSI0_D0_P: IC8.F29(CSI0_D0+)
CSI0_D1_N: IC8.H26(CSI0_D1-)
CSI0_D1_P: IC8.H27(CSI0_D1+)
CSI1_CLK_N: IC8.D27(CSI1_CLK-)
CSI1_CLK_P: IC8.D28(CSI1_CLK+)
CSI1_D0_N: IC8.C28(CSI1_D0-)
CSI1_D0_P: IC8.C29(CSI1_D0+)
CSI1_D1_N: IC8.E26(CSI1_D1-)
CSI1_D1_P: IC8.E27(CSI1_D1+)
CSI2_CLK_N: IC8.G24(CSI2_CLK-)
CSI2_CLK_P: IC8.G25(CSI2_CLK+)
CSI2_D0_N: IC8.F25(CSI2_D0-)
CSI2_D0_P: IC8.F26(CSI2_D0+)
CSI2_D1_N: IC8.H23(CSI2_D1-)
CSI2_D1_P: IC8.H24(CSI2_D1+)
CSI3_CLK_N: IC8.D24(CSI3_CLK-)
CSI3_CLK_P: IC8.D25(CSI3_CLK+)
CSI3_D0_N: IC8.C25(CSI3_D0-)
CSI3_D0_P: IC8.C26(CSI3_D0+)
CSI3_D1_N: IC8.E23(CSI3_D1-)
CSI3_D1_P: IC8.E24(CSI3_D1+)
CSI4_CLK_N: IC8.G21(CSI4_CLK-)
CSI4_CLK_P: IC8.G22(CSI4_CLK+)
CSI4_D0_N: IC8.F22(CSI4_D0-)
CSI4_D0_P: IC8.F23(CSI4_D0+)
CSI4_D1_N: IC8.H20(CSI4_D1-)
CSI4_D1_P: IC8.H21(CSI4_D1+)
CSI5_CLK_N: IC8.D21(CSI5_CLK-)
CSI5_CLK_P: IC8.D22(CSI5_CLK+)
CSI5_D0_N: IC8.C22(CSI5_D0-)
CSI5_D0_P: IC8.C23(CSI5_D0+)
CSI5_D1_N: IC8.E20(CSI5_D1-)
CSI5_D1_P: IC8.E21(CSI5_D1+)
DBG_UART_RxD_1V8: IC8.G12(UART0_RX)
DBG_UART_TxD_1V8: IC8.H12(UART0_TX)
GBE_LED0: IC8.E47(GBE_LINK_ACT#)
GBE_LED1: IC8.F50(GBE_LINK100#)
GBE_MDI0_N: IC8.E49(GBE_MDI0-)
GBE_MDI0_P: IC8.E48(GBE_MDI0+)
GBE_MDI1_N: IC8.F48(GBE_MDI1-)
GBE_MDI1_P: IC8.F47(GBE_MDI1+)
GBE_MDI2_N: IC8.G49(GBE_MDI2-)
GBE_MDI2_P: IC8.G48(GBE_MDI2+)
GBE_MDI3_N: IC8.H48(GBE_MDI3-)
GBE_MDI3_P: IC8.H47(GBE_MDI3+)
GPIO0_CAM0_PWR: IC8.G8(GPIO0_CAM0_PWR#)
GPIO1_CAM1_PWR: IC8.F7(GPIO1_CAM1_PWR#)
GPIO2_CAM0_RST: IC8.H8(GPIO2_CAM0_RST#)
GPIO3_CAM1_RST: IC8.H7(GPIO3_CAM1_RST#)
GPIO4_CAM_STROBE: IC8.G7(GPIO4_CAM_STROBE)
GPIO5_CAM_FLASH_EN: IC8.D7(GPIO5_CAM_FLASH_EN)
GPIO19: IC8.F2(GPIO19_AUD_RST)
I2C_GP0_SCL_1V8: IC8.E15(I2C_GP0_CLK)
I2C_GP0_SDA_1V8: IC8.D15(I2C_GP0_DAT)
I2C_GP1_SCL: IC8.A21(I2C_GP1_CLK)
I2C_GP1_SDA: IC8.A20(I2C_GP1_DAT)
PCI_SATA_SEL: IC8.B21(GPIO12_BT_EN)
PEX_CLK_N: IC8.A45(PX0_REFCLK-)
PEX_CLK_P: IC8.A44(PEX0_REFCLK+)
PEX_CLKREQ: IC8.C48(PEX0_CLKREQ#)
PEX_RST: IC8.C49(PEX0_RST#)
PEX_RX_N: IC8.H45(PEX0_RX-)
PEX_RX_P: IC8.H44(PEX0_RX+)
PEX_TX_N: IC8.E45(PEX0_TX-)
PEX_TX_P: IC8.E44(PEX0_TX+)
PEX_WAKE: IC8.D48(PEX_WAKE#)
SATA_RX_N: IC8.G46(SATA_RX-)
SATA_RX_P: IC8.G45(SATA_RX+)
SATA_TX_N: IC8.D46(SATA_TX-)
SATA_TX_P: IC8.D45(SATA_TX+)
SD_CD: IC8.F17(SDCARD_CD#)
SD_CLK: IC8.G18(SDCARD_CLK)
SD_CMD: IC8.G19(SDCARD_CMD)
SD_DAT0: IC8.H18(SDCARD_D0)
SD_DAT1: IC8.H17(SDCARD_D1)
SD_DAT2: IC8.F19(SDCARD_D2)
SD_DAT3: IC8.F18(SDCARD_D3)
SPI2_CLK_1V8: IC8.H14(SPI2_CLK)
SPI2_CS0_1V8: IC8.G16(SPI2_CS0#)
SPI2_CS1_1V8: IC8.F16(SPI2_CS1#)
SPI2_MISO_1V8: IC8.H15(SPI2_MISO)
SPI2_MOSI_1V8: IC8.G15(SPI2_MOSI)
TMDS_CEC: IC8.B33(HDMI_CEC)
TMDS_CLK_N: IC8.E35(DP1_TX3-)
TMDS_CLK_P: IC8.E36(DP1_TX3+)
TMDS_D0_N: IC8.D36(DP1_TX2-)
TMDS_D0_P: IC8.D37(DP1_TX2+)
TMDS_D1_N: IC8.C37(DP1_TX1-)
TMDS_D1_P: IC8.C38(DP1_TX1+)
TMDS_D2_N: IC8.E38(DP1_TX0-)
TMDS_D2_P: IC8.E39(DP1_TX0+)
TMDS_HPD: IC8.A33(DP1_HPD)
TMDS_SCL_1V8: IC8.A35(DP1_AUX_CH+)
TMDS_SDA_1V8: IC8.A34(DP1_AUX_CH-)
USB0_D_N: IC8.B40(USB0_D-)
USB0_D_P: IC8.B39(USB0_D+)
USB0_ID: IC8.A36(USB0_OTG_ID)
USB0_VBUS: IC8.B37(USB0_VBUS_DET)
USB1_D_N: IC8.A39(USB1_D-)
USB1_D_P: IC8.A38(USB1_D+)
USB2_D_N: IC8.B43(USB2_D-)
USB2_D_P: IC8.B42(USB2_D+)
USB3_RX_N: IC8.F44(USB_SS0_RX-)
USB3_RX_P: IC8.F43(USB_SS0_RX+)
USB3_TX_N: IC8.C44(USB_SS0_TX-)
USB3_TX_P: IC8.C43(USB_SS0_TX+)
USB_VBUS_EN: IC8.A18(USB1_EN_OC#)

Not connected (* = marked no-connect by the designer): IC8 A6(I2C_PM_CLK)* A8(GPIO14_AP_WAKE_MDM)* A9(GPIO15_AP2MDM_READY)* A10(GPIO16_MDM_WAKE_AP)* A15(UART2_CTS#)* A16(UART2_RTS#)* A17(USB0_EN_OC#)* A29(SDIO_RST#)* A30(SDIO_D3)* A31(SDIO_D2)* A32(SDIO_D1)* B6(I2C_PM_DAT)* B9(GPIO17_MDM2AP_READY)* B10(GPIO18_MDM_COLDBOOT)* B15(UART2_RX)* B16(UART2_TX)* B19(GPIO11_AP_WAKE_BT)* B20(GPIO10_WIFI_WAKE_AP)* B22(GPIO13_BT_WAKE_AP)* B23(GPIO7_TOUCH_RST)* B25(GPIO6_TOUCH_INT)* B29(SDIO_CMD)* B30(SDIO_CLK)* B32(SDIO_D0)* D42(USB_SS1_TX+)* D43(USB_SS1_TX-)* E3(SPI0_CLK)* E4(SPI0_MISO)* E9(UART1_RTS#)* E10(UART1_CTS#)* E13(SPI1_CS1#)* E14(SPI1_CS0#)* F3(SPI0_CS0#)* F4(SPI0_MOSI)* F13(SPI1_MOSI)* F14(SPI1_MISO)* F20(SDCARD_WP)* F46(GBE_LINK1000#)* G11(UART0_RTS#)* G13(SPI1_CLK)* G14(GPIO9_MOTION_INT)* G42(USB_SS1_RX+)* G43(USB_SS1_RX-)* H3(GPIO20_AUD_INT)* H11(UART0_CTS#)* H13(GPIO8_ALS_PROX_INT)* H16(SDCARD_PWR_EN)*; M1 1*; M2 1*; M3 1*; M4 1*; M6 1*; M7 1*

### Layout directives
differential pair: CSI0_CLK_N, CSI0_CLK_P, CSI0_D0_N, CSI0_D0_P, CSI0_D1_N, CSI0_D1_P, CSI1_CLK_N, CSI1_CLK_P, CSI1_D0_N, CSI1_D0_P, CSI1_D1_N, CSI1_D1_P, CSI2_CLK_N, CSI2_CLK_P, CSI2_D0_N, CSI2_D0_P, CSI2_D1_N, CSI2_D1_P, CSI3_CLK_N, CSI3_CLK_P, CSI3_D0_N, CSI3_D0_P, CSI3_D1_N, CSI3_D1_P, CSI4_CLK_N, CSI4_CLK_P, CSI4_D0_N, CSI4_D0_P, CSI4_D1_N, CSI4_D1_P, CSI5_CLK_N, CSI5_CLK_P, CSI5_D0_N, CSI5_D0_P, CSI5_D1_N, CSI5_D1_P, GBE_MDI0_N, GBE_MDI0_P, GBE_MDI1_N, GBE_MDI1_P, GBE_MDI2_N, GBE_MDI2_P, GBE_MDI3_N, GBE_MDI3_P, PEX_RX_N, PEX_RX_P, PEX_TX_N, PEX_TX_P, SATA_RX_N, SATA_RX_P, SATA_TX_N, SATA_TX_P, TMDS_CLK_N, TMDS_CLK_P, TMDS_D0_N, TMDS_D0_P, TMDS_D1_N, TMDS_D1_P, TMDS_D2_N, TMDS_D2_P, USB0_D_N, USB0_D_P, USB1_D_N, USB1_D_P, USB2_D_N, USB2_D_P, USB3_RX_N, USB3_RX_P, USB3_TX_N, USB3_TX_P

### Notes on the sheet
- (near M5) Jetson TX - mechanical model
- (near M8) Jetson - support standoffs
- Board fastening studs
- Title:
- Size:
- Date:
- A3
- Revision:
- Page:
- of
- Antmicro Ltd.
- File:
- www.antmicro.com
- (in symbol Nvidia-TX1-Model) TX1 Model
- (in symbol Nvidia-TX1-SoM, part B) SoM Interfaces - High Speed
- (in symbol Nvidia-TX1-SoM, part D) SoM Interfaces - LowSpeed

### Library data of the parts
IC8 = Nvidia-TX1-SoM: TX1 module (board connector); Manufacturer: Samtec; Part Number: Nvidia-TX1-SoM; Part Symbol: SEAM-50-02.0-S-08-2-A-K-TR; Value: SEAM-50-02.0-S-08-2-A-K-TR
M1-M4 = WE_9774110360: M3x11.6; Manufacturer: WURTH ELEKTRONIK; Part Number: WE_9774110360; Value: 9774110360; Part Symbol: 9774110360
M5 = Nvidia-TX1-Model: TX1 module; Manufacturer: NVIDIA; Part Symbol: Jetson TX1-SoM; Part Number: Nvidia-TX1-Model; Value: Jetson TX1 SoM
M6 M7 = WE_9774030360: M3x3; Manufacturer: WURTH ELEKTRONIK; Part Number: WE_9774030360; Value: 9774030360; Part Symbol: 9774030360
M8-M11 = GENERIC_BOM_ONLY: Manufacturer: Dremec; Part Symbol: 316/3.2x07

## Sheet SoM-Unused.SchDoc
size A3; DocumentNumber: 2; SheetNumber: 2; SheetTotal: 10; PageSetup: Record=PageOptions|CenterHorizontal=True|CenterVertical=True|PrintScale=0.97|XCorrection=1.00|YCorrection=1.00|PrintKind=1|BorderSize=5000000|LeftOffset=0|BottomOffset=0|Orientation=2|PaperLength=2970|PaperWidth=2100|Scale=100|PaperSource=7|PrintQuality=600|MediaType=1|DitherType=10|PaperKind=A4|PrintScaleMode=1
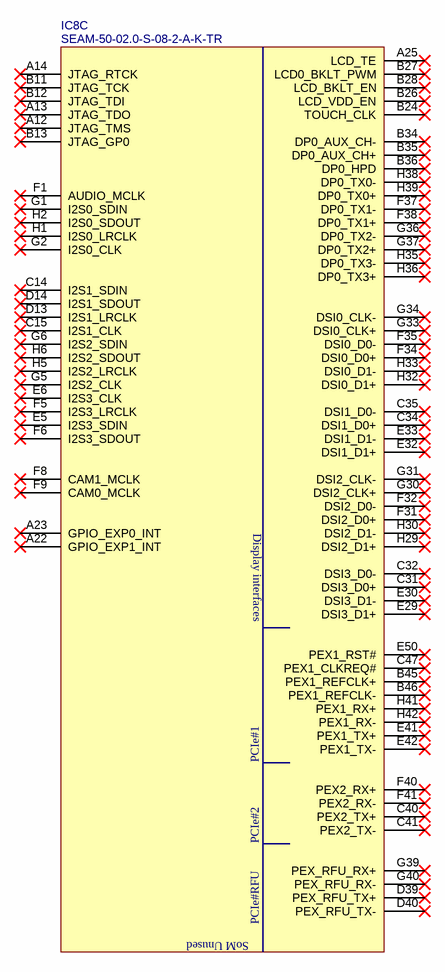
[diagram p6: SoM-Unused.SchDoc]

### Parts
IC8  SEAM-50-02.0-S-08-2-A-K-TR  [Nvidia-TX1-SoM]  (part C of 4)

### Nets

Not connected (* = marked no-connect by the designer): IC8 A12(JTAG_TMS)* A13(JTAG_TDO)* A14(JTAG_RTCK)* A22(GPIO_EXP1_INT)* A23(GPIO_EXP0_INT)* A25(LCD_TE)* B11(JTAG_TCK)* B12(JTAG_TDI)* B13(JTAG_GP0)* B24(TOUCH_CLK)* B26(LCD_VDD_EN)* B27(LCD0_BKLT_PWM)* B28(LCD_BKLT_EN)* B34(DP0_AUX_CH-)* B35(DP0_AUX_CH+)* B36(DP0_HPD)* B45(PEX1_REFCLK+)* B46(PEX1_REFCLK-)* C14(I2S1_SDIN)* C15(I2S1_CLK)* C31(DSI3_D0+)* C32(DSI3_D0-)* C34(DSI1_D0+)* C35(DSI1_D0-)* C40(PEX2_TX+)* C41(PEX2_TX-)* C47(PEX1_CLKREQ#)* D13(I2S1_LRCLK)* D14(I2S1_SDOUT)* D39(PEX_RFU_TX+)* D40(PEX_RFU_TX-)* E5(I2S3_SDIN)* E6(I2S3_CLK)* E29(DSI3_D1+)* E30(DSI3_D1-)* E32(DSI1_D1+)* E33(DSI1_D1-)* E41(PEX1_TX+)* E42(PEX1_TX-)* E50(PEX1_RST#)* F1(AUDIO_MCLK)* F5(I2S3_LRCLK)* F6(I2S3_SDOUT)* F8(CAM1_MCLK)* F9(CAM0_MCLK)* F31(DSI2_D0+)* F32(DSI2_D0-)* F34(DSI0_D0+)* F35(DSI0_D0-)* F37(DP0_TX1-)* F38(DP0_TX1+)* F40(PEX2_RX+)* F41(PEX2_RX-)* G1(I2S0_SDIN)* G2(I2S0_CLK)* G5(I2S2_CLK)* G6(I2S2_SDIN)* G30(DSI2_CLK+)* G31(DSI2_CLK-)* G33(DSI0_CLK+)* G34(DSI0_CLK-)* G36(DP0_TX2-)* G37(DP0_TX2+)* G39(PEX_RFU_RX+)* G40(PEX_RFU_RX-)* H1(I2S0_LRCLK)* H2(I2S0_SDOUT)* H5(I2S2_LRCLK)* H6(I2S2_SDOUT)* H29(DSI2_D1+)* H30(DSI2_D1-)* H32(DSI0_D1+)* H33(DSI0_D1-)* H35(DP0_TX3-)* H36(DP0_TX3+)* H38(DP0_TX0-)* H39(DP0_TX0+)* H41(PEX1_RX+)* H42(PEX1_RX-)*

### Notes on the sheet
- Title:
- Size:
- Date:
- A3
- Revision:
- Page:
- of
- Antmicro Ltd.
- File:
- www.antmicro.com
- (in symbol Nvidia-TX1-SoM, part C) Display interfaces; PCIe#1; PCIe#2; PCIe#RFU; SoM Unused

### Library data of the parts
IC8 = Nvidia-TX1-SoM: as IC8 on sheet SoM-Interfaces; Part Number: Nvidia-TX1-SoM; Part Symbol: SEAM-50-02.0-S-08-2-A-K-TR; Value: SEAM-50-02.0-S-08-2-A-K-TR

## Sheet Supply.SchDoc
size A3; DocumentNumber: 3; SheetNumber: 3; SheetTotal: 10; PageSetup: Record=PageOptions|CenterHorizontal=True|CenterVertical=True|PrintScale=0.97|XCorrection=1.00|YCorrection=1.00|PrintKind=1|BorderSize=5000000|LeftOffset=0|BottomOffset=0|Orientation=2|PaperLength=2970|PaperWidth=2100|Scale=100|PaperSource=7|PrintQuality=600|MediaType=1|DitherType=10|PaperKind=A4|PrintScaleMode=1
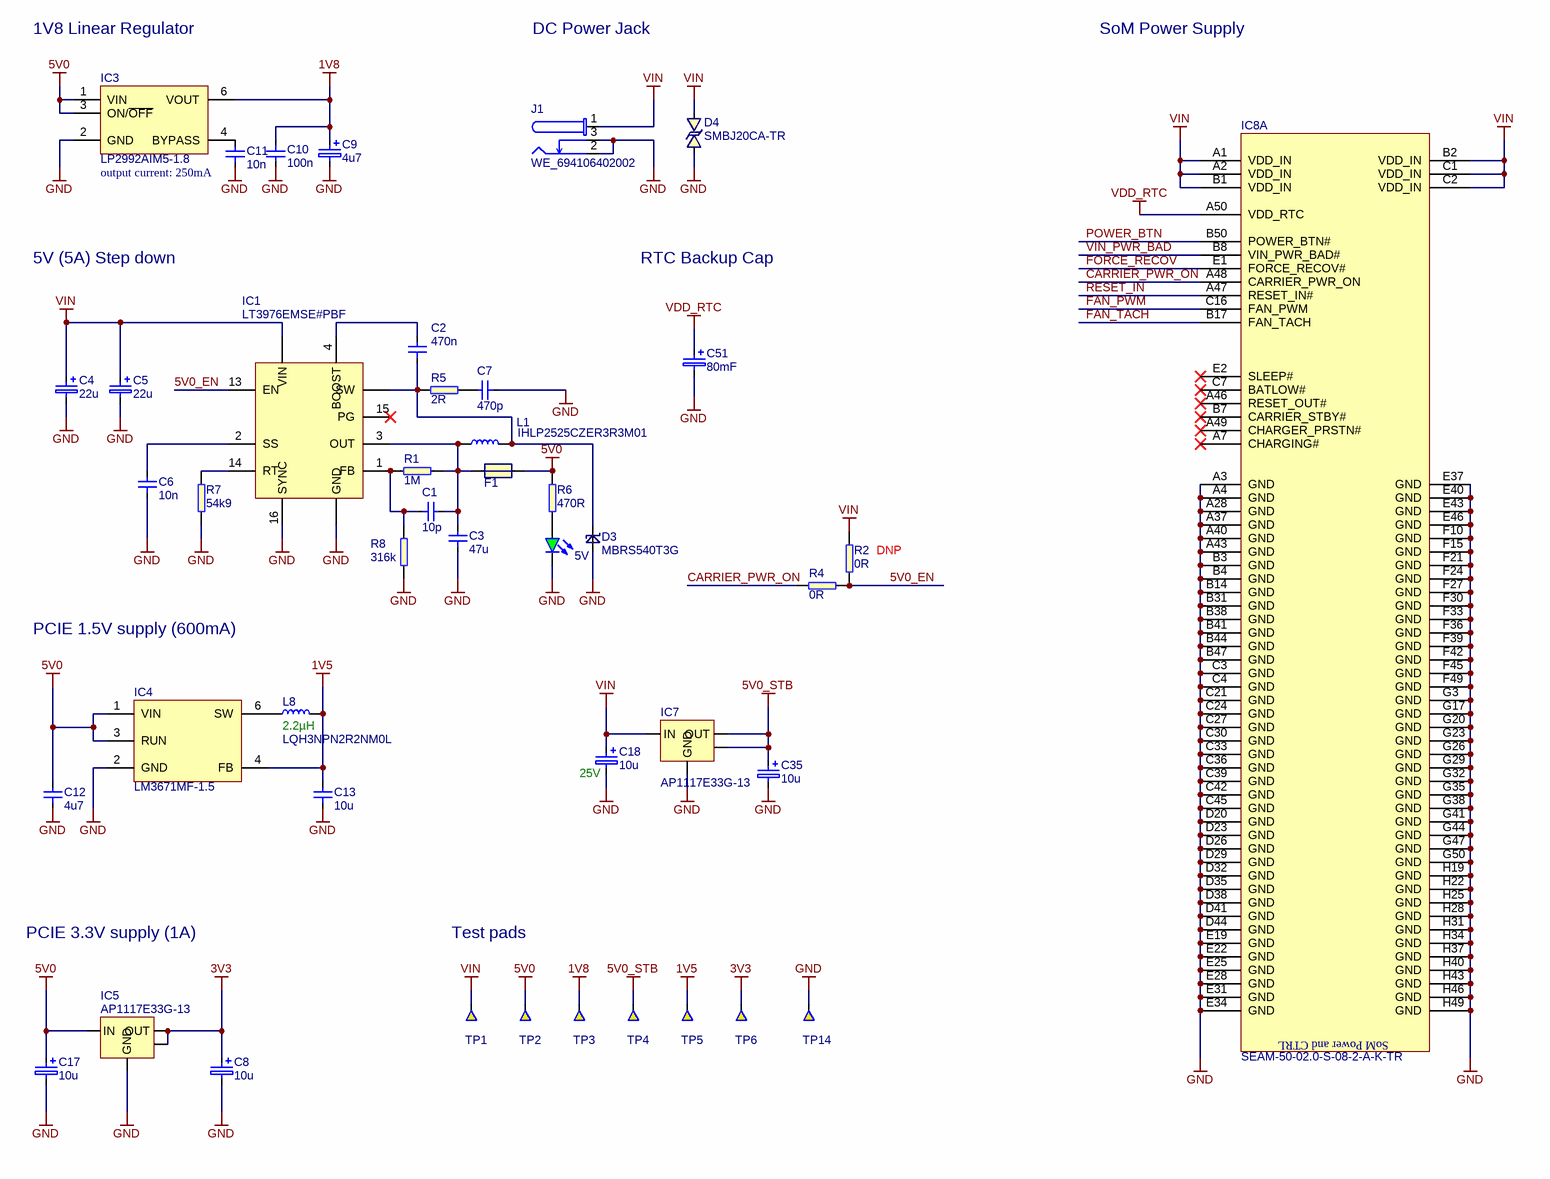
[diagram p7: Supply.SchDoc]

### Parts
5V  KPT-1608SGC  [LED0603]  (value not drawn)
C1  10p  [0603]
C2  470n  [0603]
C3  47u  [1206]
C4  22u  [KEMET_C]
C5  22u  [KEMET_C]
C6  10n  [0603]
C7  470p  [0603]
C8  10u  [KEMET_A]
C9  4u7  [KEMET_A]
C10  100n  [0603]
C11  10n  [0603]
C12  4u7  [0603]
C13  10u  [0603]
C17  10u  [KEMET_A]
C18  10u  [KEMET_C]
C35  10u  [KEMET_A]
C51  80mF  [XH414HG-IV01E]
D3  MBRS540T3G  [SMC-403-03]
D4  SMBJ20CA-TR  [DO-214AA]
F1  3.0A  [Fuse-MF-LSMF]  (value not drawn)
IC1  LT3976EMSE#PBF  [LT3976EMSE]
IC3  LP2992AIM5-1.8  [SOT23-5N]
IC4  LM3671MF-1.5  [SOT23-5N]
IC5  AP1117E33G-13  [SOT223]
IC7  AP1117E33G-13  [SOT223]
IC8  SEAM-50-02.0-S-08-2-A-K-TR  [Nvidia-TX1-SoM]  (part A of 4)
J1  WE_694106402002  [WE_694106402002]
L1  IHLP2525CZER3R3M01  [IHLP-2525CZ-01]
L8  LQH3NPN2R2NM0L  [LQH3NPN2R2NM]
R1  1M  [0603]
R2  0R  [0603]
R4  0R  [0603]
R5  2R  [0603]
R6  470R  [0603]
R7  54k9  [0603]
R8  316k  [0603]
TP1  (no value)  [TP-R-2]  (no BOM)
TP2  (no value)  [TP-R-2]  (no BOM)
TP3  (no value)  [TP-R-2]  (no BOM)
TP4  (no value)  [TP-R-2]  (no BOM)
TP5  (no value)  [TP-R-2]  (no BOM)
TP6  (no value)  [TP-R-2]  (no BOM)
TP14  (no value)  [TP-R-2]  (no BOM)

### Nets
1V5: C13.2 IC4.4(FB) L8.2 TP5.1
1V8: C9.1 C10.1 IC3.6(VOUT) TP3.1
3V3: C8.1 IC5.2(OUT) IC5.4(OUT) TP6.1
5V0: C12.2 C17.1 F1.2 IC3.1(VIN) IC3.3(ON/~{OFF}) IC4.1(VIN) IC4.3(RUN) IC5.3(IN) R6.2 TP2.1
5V0_STB: C35.1 IC7.2(OUT) IC7.4(OUT) TP4.1
GND: 5V.K C3.1 C4.2 C5.2 C6.1 C7.1 C8.2 C9.2 C10.2 C11.1 C12.1 C13.1 C17.2 C18.2 C35.2 C51.2 D3.A D4.A IC1.16(SYNC) IC1.GND IC3.2(GND) IC4.2(GND) IC5.1(GND) IC7.1(GND) IC8.A3(GND) IC8.A4(GND) IC8.A28(GND) IC8.A37(GND) IC8.A40(GND) IC8.A43(GND) IC8.B3(GND) IC8.B4(GND) IC8.B14(GND) IC8.B31(GND) IC8.B38(GND) IC8.B41(GND) IC8.B44(GND) IC8.B47(GND) IC8.C3(GND) IC8.C4(GND) IC8.C21(GND) IC8.C24(GND) IC8.C27(GND) IC8.C30(GND) IC8.C33(GND) IC8.C36(GND) IC8.C39(GND) IC8.C42(GND) IC8.C45(GND) IC8.D20(GND) IC8.D23(GND) IC8.D26(GND) IC8.D29(GND) IC8.D32(GND) IC8.D35(GND) IC8.D38(GND) IC8.D41(GND) IC8.D44(GND) IC8.E19(GND) IC8.E22(GND) IC8.E25(GND) IC8.E28(GND) IC8.E31(GND) IC8.E34(GND) IC8.E37(GND) IC8.E40(GND) IC8.E43(GND) IC8.E46(GND) IC8.F10(GND) IC8.F15(GND) IC8.F21(GND) IC8.F24(GND) IC8.F27(GND) IC8.F30(GND) IC8.F33(GND) IC8.F36(GND) IC8.F39(GND) IC8.F42(GND) IC8.F45(GND) IC8.F49(GND) IC8.G3(GND) IC8.G17(GND) IC8.G20(GND) IC8.G23(GND) IC8.G26(GND) IC8.G29(GND) IC8.G32(GND) IC8.G35(GND) IC8.G38(GND) IC8.G41(GND) IC8.G44(GND) IC8.G47(GND) IC8.G50(GND) IC8.H19(GND) IC8.H22(GND) IC8.H25(GND) IC8.H28(GND) IC8.H31(GND) IC8.H34(GND) IC8.H37(GND) IC8.H40(GND) IC8.H43(GND) IC8.H46(GND) IC8.H49(GND) J1.2 J1.3 R7.1 R8.1 TP14.1
VDD_RTC: C51.1 IC8.A50(VDD_RTC)
VIN: C4.1 C5.1 C18.1 D4.C IC1.VIN IC7.3(IN) IC8.A1(VDD_IN) IC8.A2(VDD_IN) IC8.B1(VDD_IN) IC8.B2(VDD_IN) IC8.C1(VDD_IN) IC8.C2(VDD_IN) J1.1 R2.2 TP1.1
5V0_EN: IC1.13(EN) R2.1 R4.1
CARRIER_PWR_ON: IC8.A48(CARRIER_PWR_ON) R4.2
FAN_PWM: IC8.C16(FAN_PWM)
FAN_TACH: IC8.B17(FAN_TACH)
FORCE_RECOV: IC8.E1(FORCE_RECOV#)
POWER_BTN: IC8.B50(POWER_BTN#)
RESET_IN: IC8.A47(RESET_IN#)
VIN_PWR_BAD: IC8.B8(VIN_PWR_BAD#)
Net5V_A: 5V.A R6.1
NetC1_1: C1.1 IC1.1(FB) R1.2 R8.2
NetC1_2: C1.2 C3.2 F1.1 IC1.3(OUT) L1.2 R1.1
NetC2_1: C2.1 D3.C IC1.SW L1.1 R5.2
NetC2_2: C2.2 IC1.4(BOOST)
NetC6_2: C6.2 IC1.2(SS)
NetC7_2: C7.2 R5.1
NetC11_2: C11.2 IC3.4(BYPASS)
NetIC1_14: IC1.14(RT) R7.2
NetIC4_6: IC4.6(SW) L8.1

Not connected (* = marked no-connect by the designer): IC1 15(PG)*; IC8 A7(CHARGING#)* A46(RESET_OUT#)* A49(CHARGER_PRSTN#)* B7(CARRIER_STBY#)* C7(BATLOW#)* E2(SLEEP#)*

### Notes on the sheet
- 1V8 Linear Regulator
- DC Power Jack
- SoM Power Supply
- (near C11) output current: 250mA
- 5V (5A) Step down
- RTC Backup Cap
- (near R2) DNP
- PCIE 1.5V supply (600mA)
- (near L8) 2.2µH
- (near C18) 25V
- PCIE 3.3V supply (1A)
- Test pads
- Title:
- Size:
- Date:
- A3
- Revision:
- Page:
- of
- Antmicro Ltd.
- File:
- www.antmicro.com
- (in symbol Nvidia-TX1-SoM, part A) SoM Power and CTRL

### Library data of the parts
5V = LED_G: LED Green 0603 case; Manufacturer: KINGBRIGHT; Part Number: LED_G; Value: KPT-1608SGC; Part Symbol: KPT-1608SGC
C1 = C_10p_0603: as C44 on sheet Misc; Value: 10p; Part Number: C_10p_0603
C2 = C_470n_0603: MLCC SMT Capacitor 470nF 0603; Manufacturer: TDK; Part Symbol: C1608X5R1H474K080AB; Value: 470n; Part Number: C_470n_0603
C3 = C_47u_1206: MLCC SMT Capacitor 47uF 1206; Manufacturer: MURATA; Part Symbol: GRM31CC80J476KE18L; Value: 47u; Part Number: C_47u_1206
C4 C5 = C_22u_KEMET_C: Tantalum SMT Capacitor 22uF Case KEMET_C; Manufacturer: KEMET; Part Symbol: T491C226K025AT; Part Number: C_22u_KEMET_C; Value: 22u
C6 C11 = C_10n_0603: MLCC SMT Capacitor 10nF 0603; Manufacturer: AVX; Part Symbol: 06031C103JAT2A; Value: 10n; Part Number: C_10n_0603
C7 = C_470p_0603: MLCC SMT Capacitor 470pF 0603; Manufacturer: AVX; Part Symbol: 06031C471JAT2A; Value: 470p; Part Number: C_470p_0603
C8 C17 C35 = C_10u_KEMET_A: Tantalum SMT Capacitor 10uF Case KEMET_A; Manufacturer: VISHAY; Part Symbol: 293D106X9016A2TE3; Value: 10u; Part Number: C_10u_KEMET_A
C9 = C_4u7_KEMET_A: Tantalum SMT Capacitor 4u7F Case KEMET_A; Manufacturer: KEMET; Part Symbol: T491A475K010AT; Value: 4u7; Part Number: C_4u7_KEMET_A
C10 = C_100n_0603: as C26 on sheet HDMI; Value: 100n; Part Number: C_100n_0603
C12 = C_4u7_0603: MLCC SMT Capacitor 4u7F 0603; Manufacturer: MULTICOMP; Part Symbol: MC0603X475K6R3CT; Value: 4u7; Part Number: C_4u7_0603
C13 = C_10u_0603: as C52 on sheet Misc; Value: 10u; Part Number: C_10u_0603
C18 = C_10u_KEMET_C: Tantalum SMT Capacitor 10uF Case KEMET_C; Manufacturer: KEMET; Part Symbol: T491C106K025AT; Part Number: C_10u_KEMET_C; Value: 10u
C51 = XH414HG-IV01E: CAP 80MF 3.3V SURFACE MOUNT; Manufacturer: SEIKO; Part Number: XH414HG-IV01E; Value: 80mF; Part Symbol: XH414HG-IV01E
D3 = MBRS540T3G: ON SEMICONDUCTOR  MBRS540T3G  Rectifier Diode, Single, 40 V, 5 A, 500 mV, 190 A; Part Number: MBRS540T3G; Value: MBRS540T3G; Manufacturer: ON SEMICONDUCTOR; Part Symbol: MBRS540T3G
D4 = SMBJ20CA: DIODE, TVS, 20V, 600W; Manufacturer: STMICROELECTRONICS; Part Number: SMBJ20CA; Value: SMBJ20CA-TR; Part Symbol: SMBJ20CA-TR
F1 = MF-LSMF300X-2: 3.0A, 6V, PTC Resettabe Fuse; Manufacturer: BOURNS; Part Number: MF-LSMF300X-2; Value: 3.0A; Part Symbol: MF-LSMF300X-2
IC1 = LT3976: LINEAR TECHNOLOGY  LT3976EMSE#PBF  DC-DC CONVERTER, 2MHZ, 5A, MSOP-16; Part Number: LT3976EMSE#PBF; Value: LT3976EMSE#PBF; Manufacturer: LINEAR TECHNOLOGY; Part Symbol: LT3976EMSE#PBF
IC3 = LP2992AIM5-1.8: LDO 1.8V 250mA; Manufacturer: TEXAS INSTRUMENTS; Part Symbol: LP2992AIM5-1.8/NOPB; Part Number: LP2992AIM5-1.8; Value: LP2992AIM5-1.8
IC4 = LM3671: DC/DC Buck Converter; Manufacturer: TEXAS INSTRUMENTS; Part Symbol: LM3671MF-1.5/NOPB; Part Number: LM3671MF-1.5; Value: LM3671MF-1.5
IC5 IC7 = AP1117E33G-13: IC, LDO, REG, 3.3V, SOT223; Manufacturer: DIODES INC.; Value: AP1117E33G-13; Part Number: AP1117E33G-13; Part Symbol: AP1117E33G-13
IC8 = Nvidia-TX1-SoM: as IC8 on sheet SoM-Interfaces; Part Number: Nvidia-TX1-SoM; Part Symbol: SEAM-50-02.0-S-08-2-A-K-TR; Value: SEAM-50-02.0-S-08-2-A-K-TR
J1 = WE_694106402002: WURTH ELEKTRONIK 	694106402002  POWER ENTRY, JACK, 2MM, VERTICAL THT, 3A; Part Number: WE_694106402002; Value: WE_694106402002; Manufacturer: WURTH ELEKTRONIK; Part Symbol: 694106402002
L1 = IHLP2525CZER3R3M01: 3.3 uH, +/- 20%, Shielded, 0.02 ohm, 8 A; Manufacturer: VISHAY; Part Number: IHLP2525CZER3R3M01; Value: IHLP2525CZER3R3M01; Part Symbol: IHLP2525CZER3R3M01
L8 = LQH3NPN2R2NM0L: INDUCTOR, 2.2 uH, +/- 30%, 1212, 90 MHz, 0.073 ohm; Manufacturer: MURATA; Part Number: LQH3NPN2R2NM0L; Value: LQH3NPN2R2NM0L; Part Symbol: LQH3NPN2R2NM0L
R1 = R_1M_0603: SMT Resistor 1M 0603; Manufacturer: BOURNS; Part Symbol: CR0603-JW-105GLF; Value: 1M; Part Number: R_1M_0603
R2 R4 = R_0R_0603: as R71 on sheet ID-Serial; Part Number: R_0R_0603; Value: 0R
R5 = R_2R_0603: SMT Resistor 2R 0603; Manufacturer: MULTICOMP; Part Symbol: MCSR06W2R00FTL; Value: 2R; Part Number: R_2R_0603
R6 = R_470R_0603: SMT Resistor 470R 0603; Manufacturer: BOURNS; Part Symbol: CR0603-JW-471GLF; Value: 470R; Part Number: R_470R_0603
R7 = R_54k9_0603: SMT Resistor 54k9 0603; Manufacturer: PANASONIC ELECTRONIC COMPONENTS; Part Symbol: ERJ3EKF5492V; Value: 54k9; Part Number: R_54k9_0603
R8 = R_316k_0603: SMT Resistor 316k 0603; Manufacturer: MULTICOMP; Part Symbol: MC0063W06031316K; Value: 316k; Part Number: R_316k_0603
TP1-TP6 TP14 = TP-R-2: Testpad, round, 2mm; Part Number: TP-R-2

## Sheet UART.SchDoc
size A3; DocumentNumber: 4; SheetNumber: 4; SheetTotal: 10; PageSetup: Record=PageOptions|CenterHorizontal=True|CenterVertical=True|PrintScale=0.97|XCorrection=1.00|YCorrection=1.00|PrintKind=1|BorderSize=5000000|LeftOffset=0|BottomOffset=0|Orientation=2|PaperLength=2970|PaperWidth=2100|Scale=100|PaperSource=7|PrintQuality=600|MediaType=1|DitherType=10|PaperKind=A4|PrintScaleMode=1
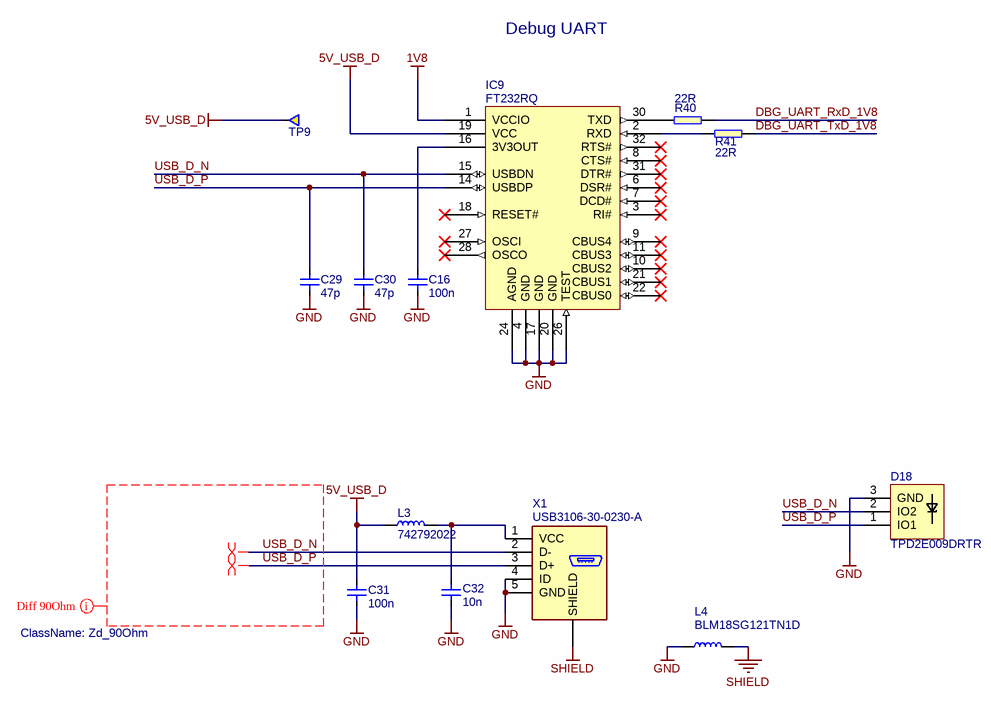
[diagram p8: UART.SchDoc]

### Parts
C16  100n  [0603]
C29  47p  [0402]
C30  47p  [0402]
C31  100n  [0603]
C32  10n  [0603]
D18  TPD2E009DRTR  [SOT-3]
IC9  FT232RQ  [QFN-32]
L3  742792022  [0805]
L4  BLM18SG121TN1D  [0603]
R40  22R  [0603]
R41  22R  [0603]
TP9  (no value)  [TP-R-2]  (no BOM)
X1  USB3106-30-0230-A  [USB3106]

### Nets
1V8: IC9.1(VCCIO)
5V_USB_D: C31.2 IC9.19(VCC) L3.1 TP9.1
GND: C16.1 C29.1 C30.1 C31.1 C32.2 D18.3(GND) IC9.4(GND) IC9.17(GND) IC9.20(GND) IC9.24(AGND) IC9.26(TEST) L4.1 X1.4(ID) X1.5(GND)
SHIELD: L4.2 X1.S(SHIELD)
DBG_UART_RxD_1V8: R40.2
DBG_UART_TxD_1V8: R41.2
USB_D_N: C30.2 D18.2(IO2) IC9.15(USBDN) X1.2(D-)
USB_D_P: C29.2 D18.1(IO1) IC9.14(USBDP) X1.3(D+)
NetC16_2: C16.2 IC9.16(3V3OUT)
NetC32_1: C32.1 L3.2 X1.1(VCC)
NetIC9_2: IC9.2(RXD) R41.1
NetIC9_30: IC9.30(TXD) R40.1

Not connected (* = marked no-connect by the designer): IC9 3(RI#)* 6(DSR#)* 7(DCD#)* 8(CTS#)* 9(CBUS4)* 10(CBUS2)* 11(CBUS3)* 18(RESET#)* 21(CBUS1)* 22(CBUS0)* 27(OSCI)* 28(OSCO)* 31(DTR#)* 32(RTS#)*

### Layout directives
differential pair: USB_D_N, USB_D_P
net class Zd_90Ohm: USB_D_N, USB_D_P

### Notes on the sheet
- Debug UART
- Title:
- Size:
- Date:
- A3
- Revision:
- Page:
- of
- Antmicro Ltd.
- File:
- www.antmicro.com

### Library data of the parts
C16 C31 = C_100n_0603: as C26 on sheet HDMI; Part Number: C_100n_0603; Value: 100n
C29 C30 = C_47p_0402: MLCC SMT Capacitor 47pF 0402; Manufacturer: KEMET; Part Symbol: C0402C470J5GACTU; Part Number: C_47p_0402; Value: 47p
C32 = C_10n_0603: as C6 on sheet Supply; Value: 10n; Part Number: C_10n_0603
D18 = TPD2E009: ESD Suppressors 2-CH; Manufacturer: Texas Instruments; Part Number: TPD2E009DRTR; Value: TPD2E009DRTR; Part Symbol: TPD2E009DRTR
IC9 = FT232RQ: USB to serial UART interface; Manufacturer: FTDI; Part Symbol: FT232RQ-REEL; Part Number: FT232RQ; Value: FT232RQ
L3 = 742792022: WURTH ELEKTRONIK - 742792022 - FERRITE BEAD, 0.05OHM, 2A, 0805; Part Number: 742792022; Value: 742792022; Manufacturer: WURTH ELEKTRONIK; Part Symbol: 742792022
L4 = BLM18SG121TN1D: as L2 on sheet HDMI; Part Number: BLM18SG121TN1D; Value: BLM18SG121TN1D; Part Symbol: BLM18SG121TN1D
R40 R41 = R_22R_0603: SMT Resistor 22R 0603; Manufacturer: BOURNS; Part Symbol: CR0603-JW-220GLF; Part Number: R_22R_0603; Value: 22R
TP9 = TP-R-2: Testpad, round, 2mm; Part Number: TP-R-2
X1 = Micro USB A/B TH Vert: Micro USB A/B TH Vertical; Manufacturer: GLOBAL CONNECTOR TECHNOLOGY; Part Symbol: USB3105-30-A; Part Number: Micro USB A/B TH Vert; Value: USB3106-30-0230-A

## Sheet USB.SchDoc
size A3; DocumentNumber: 5; SheetNumber: 5; SheetTotal: 10; PageSetup: Record=PageOptions|CenterHorizontal=True|CenterVertical=True|PrintScale=0.97|XCorrection=1.00|YCorrection=1.00|PrintKind=1|BorderSize=5000000|LeftOffset=0|BottomOffset=0|Orientation=2|PaperLength=2970|PaperWidth=2100|Scale=100|PaperSource=7|PrintQuality=600|MediaType=1|DitherType=10|PaperKind=A4|PrintScaleMode=1
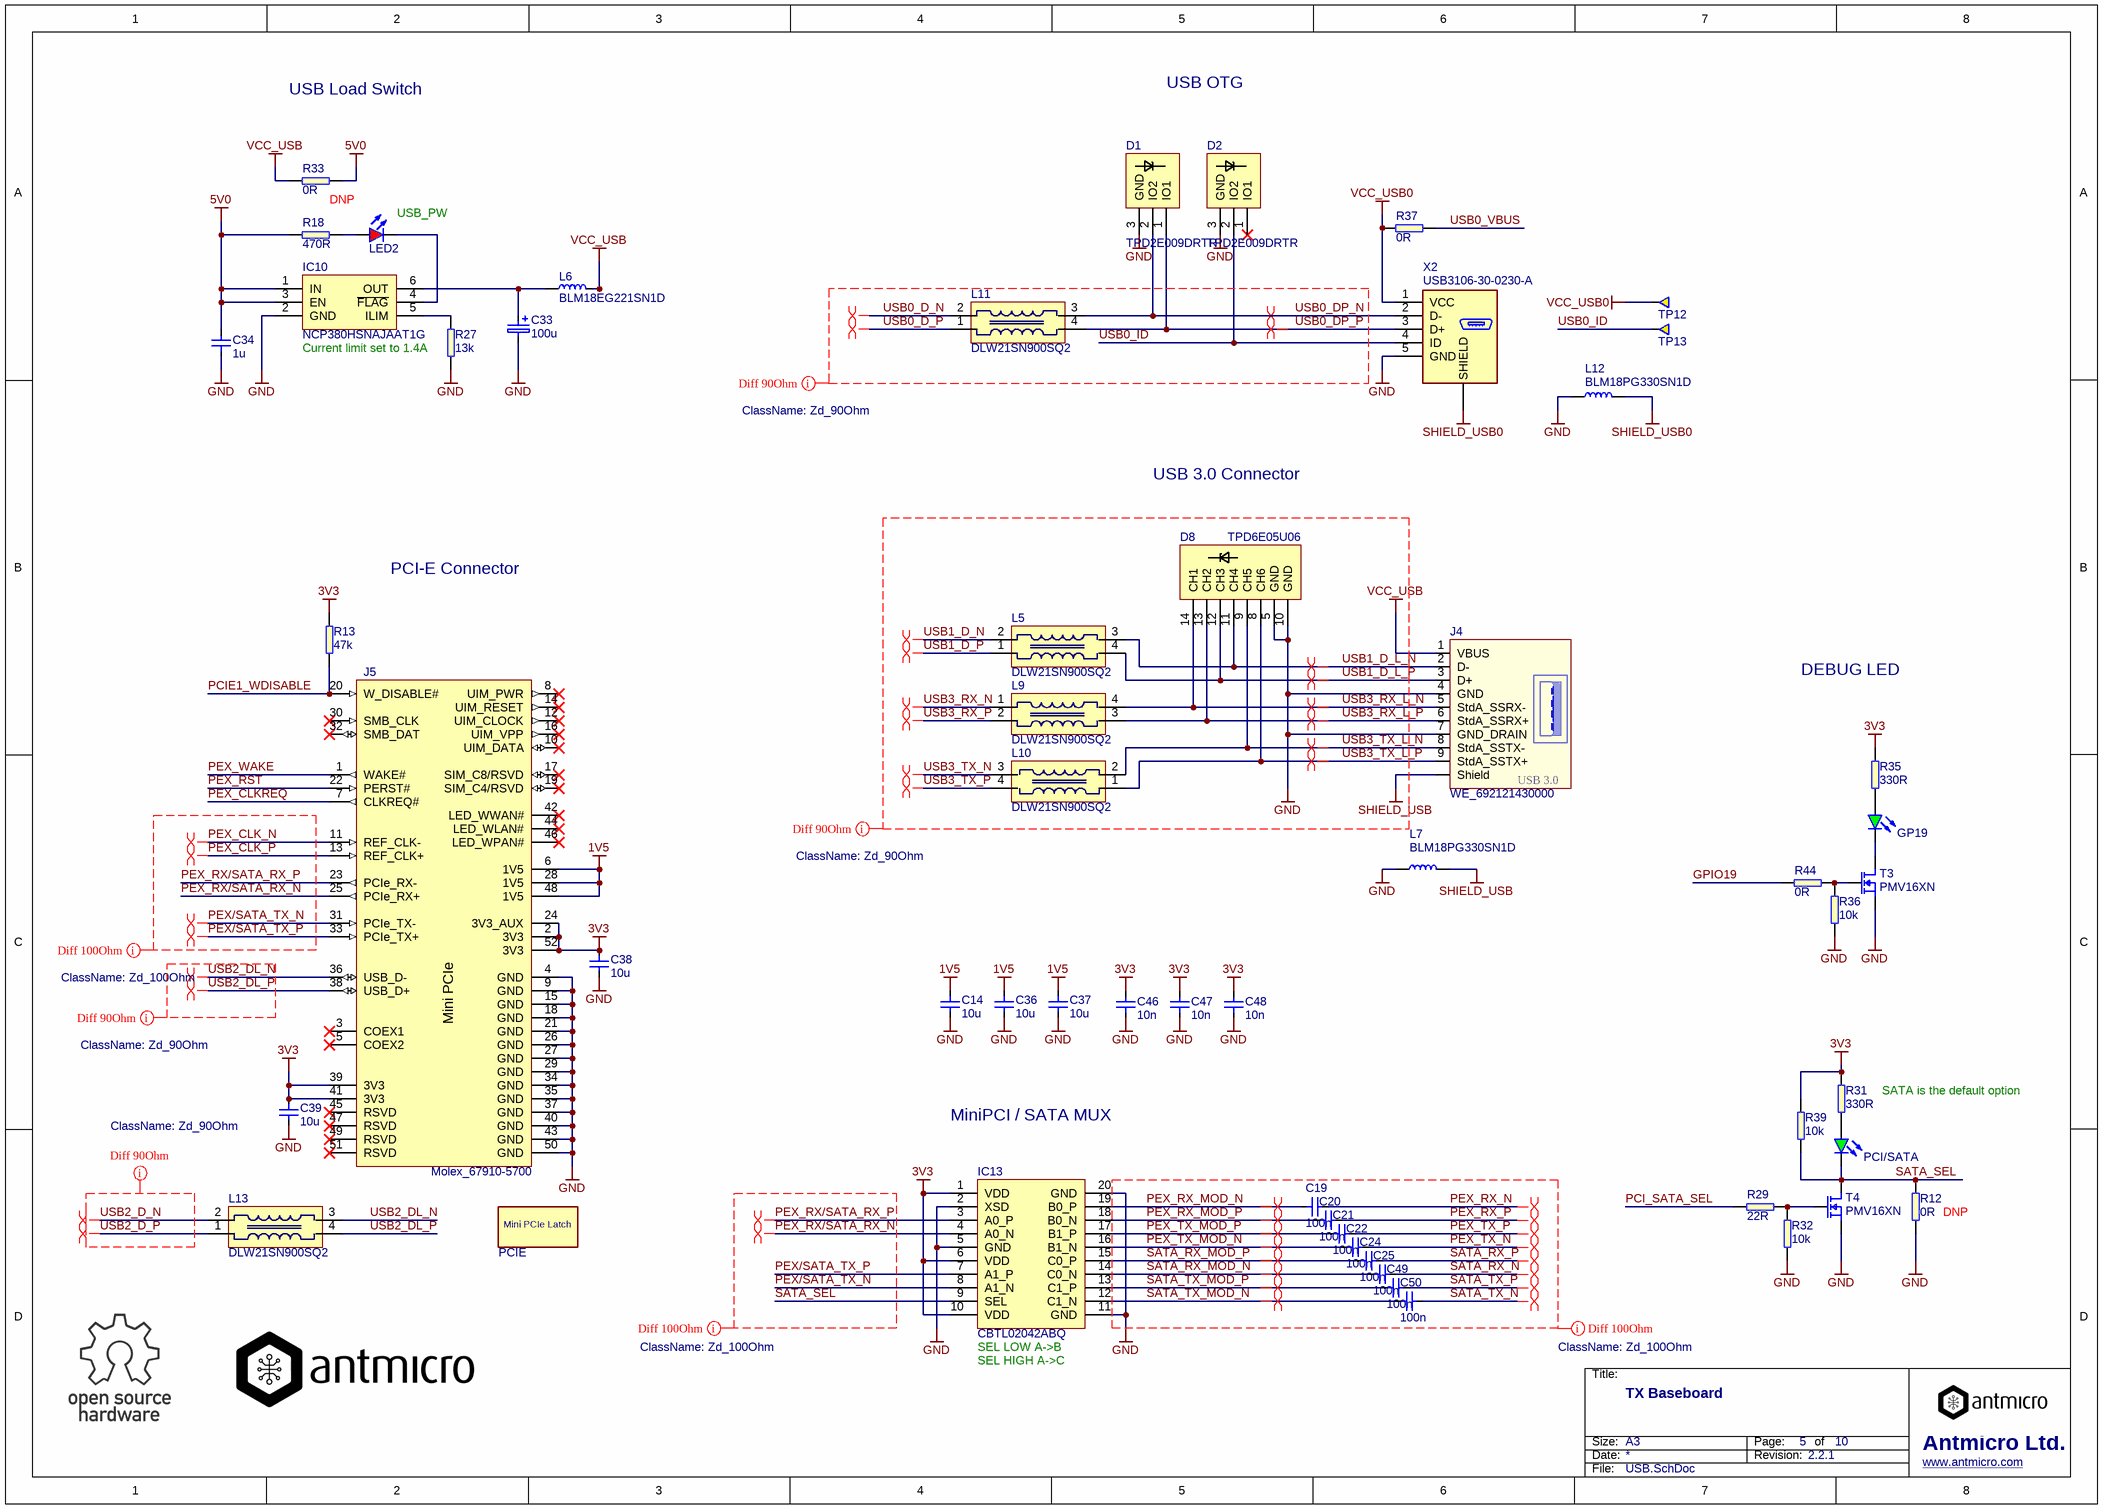
[diagram p9: USB.SchDoc]

### Parts
C14  10u  [0603]
C19  100n  [0402]
C20  100n  [0402]
C21  100n  [0402]
C22  100n  [0402]
C24  100n  [0402]
C25  100n  [0402]
C33  100u  [KEMET_A]
C34  1u  [0603]
C36  10u  [0603]
C37  10u  [0603]
C38  10u  [0603]
C39  10u  [0603]
C46  10n  [0603]
C47  10n  [0603]
C48  10n  [0603]
C49  100n  [0402]
C50  100n  [0402]
D1  TPD2E009DRTR  [SOT-3]
D2  TPD2E009DRTR  [SOT-3]
D8  TPD6E05U06  [TPD6E05U06_PASS]
GP19  KPT-1608SGC  [LED0603]  (value not drawn)
IC10  NCP380HSNAJAAT1G  [TSOP-6]
IC13  CBTL02042ABQ  [DHVQFN20]
J4  WE_692121430000  [WE_692121430000]
J5  Molex_67910-5700  [T_Molex_67910-5700]
L5  DLW21SN900SQ2  [DLW21SN900SQ2]
L6  BLM18EG221SN1D  [0603]
L7  BLM18PG330SN1D  [0603]
L9  DLW21SN900SQ2  [DLW21SN900SQ2]
L10  DLW21SN900SQ2  [DLW21SN900SQ2]
L11  DLW21SN900SQ2  [DLW21SN900SQ2]
L12  BLM18PG330SN1D  [0603]
L13  DLW21SN900SQ2  [DLW21SN900SQ2]
LED2  KPT-1608EC  [LED0603]  (value not drawn)
PCI/SATA  KPT-1608SGC  [LED0603]  (value not drawn)
PCIE  MECH-Molex-48099-5701  [MECH-Molex-48099-5701]  (value not drawn)  (mechanical)
R12  0R  [0603]
R13  47k  [0603]
R18  470R  [0603]
R27  13k  [0603]
R29  22R  [0603]
R31  330R  [0603]
R32  10k  [0603]
R33  0R  [0603]
R35  330R  [0603]
R36  10k  [0603]
R37  0R  [0603]
R39  10k  [0603]
R44  0R  [0603]
T3  PMV16XN  [SOT-23]
T4  PMV16XN  [SOT-23]
TP12  (no value)  [TP-R-2]  (no BOM)
TP13  (no value)  [TP-R-2]  (no BOM)
X2  USB3106-30-0230-A  [USB3106]

### Nets
1V5: C14.1 C36.1 C37.1 J5.6(1V5) J5.28(1V5) J5.48(1V5)
3V3: C38.1 C39.1 C46.2 C47.2 C48.2 IC13.1(VDD) IC13.6(VDD) IC13.10(VDD) J5.2(3V3) J5.24(3V3_AUX) J5.39(3V3) J5.41(3V3) J5.52(3V3) R13.2 R31.2 R35.2 R39.2
5V0: C34.2 IC10.1(IN) IC10.3(EN) R18.2 R33.2
GND: C14.2 C33.2 C34.1 C36.2 C37.2 C38.2 C39.2 C46.1 C47.1 C48.1 D1.3(GND) D2.3(GND) D8.5(GND) D8.10(GND) IC10.2(GND) IC13.2(XSD) IC13.5(GND) IC13.11(GND) IC13.20(GND) J4.4(GND) J4.7(GND_DRAIN) J5.4(GND) J5.9(GND) J5.15(GND) J5.18(GND) J5.21(GND) J5.26(GND) J5.27(GND) J5.29(GND) J5.34(GND) J5.35(GND) J5.37(GND) J5.40(GND) J5.43(GND) J5.50(GND) L7.1 L12.1 R12.1 R27.1 R32.1 R36.1 T3.2(S) T4.2(S) X2.5(GND)
SHIELD_USB: J4.Z1(Shield) L7.2
SHIELD_USB0: L12.2 X2.S(SHIELD)
VCC_USB: J4.1(VBUS) L6.2 R33.1
VCC_USB0: R37.1 TP12.1 X2.1(VCC)
GPIO19: R44.1
PCI_SATA_SEL: R29.1
PCIE1_WDISABLE: J5.20(W_DISABLE#) R13.1
PEX/SATA_TX_N: IC13.8(A1_N) J5.31(PCIe_TX-)
PEX/SATA_TX_P: IC13.7(A1_P) J5.33(PCIe_TX+)
PEX_CLK_N: J5.11(REF_CLK-)
PEX_CLK_P: J5.13(REF_CLK+)
PEX_CLKREQ: J5.7(CLKREQ#)
PEX_RST: J5.22(PERST#)
PEX_RX/SATA_RX_N: IC13.4(A0_N) J5.25(PCIe_RX+)
PEX_RX/SATA_RX_P: IC13.3(A0_P) J5.23(PCIe_RX-)
PEX_RX_MOD_N: C19.1 IC13.19(B0_P)
PEX_RX_MOD_P: C20.1 IC13.18(B0_N)
PEX_RX_N: C19.2
PEX_RX_P: C20.2
PEX_TX_MOD_N: C22.1 IC13.16(B1_N)
PEX_TX_MOD_P: C21.1 IC13.17(B1_P)
PEX_TX_N: C22.2
PEX_TX_P: C21.2
PEX_WAKE: J5.1(WAKE#)
SATA_RX_MOD_N: C25.1 IC13.14(C0_N)
SATA_RX_MOD_P: C24.1 IC13.15(C0_P)
SATA_RX_N: C25.2
SATA_RX_P: C24.2
SATA_SEL: IC13.9(SEL) PCI/SATA.K R12.2 R39.1 T4.3(D)
SATA_TX_MOD_N: C50.1 IC13.12(C1_N)
SATA_TX_MOD_P: C49.1 IC13.13(C1_P)
SATA_TX_N: C50.2
SATA_TX_P: C49.2
USB0_D_N: L11.2
USB0_D_P: L11.1
USB0_DP_N: D1.2(IO2) L11.3 X2.2(D-)
USB0_DP_P: D1.1(IO1) L11.4 X2.3(D+)
USB0_ID: D2.2(IO2) TP13.1 X2.4(ID)
USB0_VBUS: R37.2
USB1_D_L_N: D8.11(CH4) J4.2(D-) L5.3
USB1_D_L_P: D8.12(CH3) J4.3(D+) L5.4
USB1_D_N: L5.2
USB1_D_P: L5.1
USB2_D_N: L13.2
USB2_D_P: L13.1
USB2_DL_N: J5.36(USB_D-) L13.3
USB2_DL_P: J5.38(USB_D+) L13.4
USB3_RX_L_N: D8.14(CH1) J4.5(StdA_SSRX-) L9.4
USB3_RX_L_P: D8.13(CH2) J4.6(StdA_SSRX+) L9.3
USB3_RX_N: L9.1
USB3_RX_P: L9.2
USB3_TX_L_N: D8.9(CH5) J4.8(StdA_SSTX-) L10.2
USB3_TX_L_P: D8.8(CH6) J4.9(StdA_SSTX+) L10.1
USB3_TX_N: L10.3
USB3_TX_P: L10.4
NetC33_1: C33.1 IC10.6(OUT) L6.1
NetGP19_A: GP19.A R35.1
NetGP19_K: GP19.K T3.3(D)
NetIC10_4: IC10.4(~{FLAG}) LED2.K
NetIC10_5: IC10.5(ILIM) R27.2
NetLED2_A: LED2.A R18.1
NetPCI/SATA_A: PCI/SATA.A R31.1
NetR29_2: R29.2 R32.2 T4.1(G)
NetR36_2: R36.2 R44.2 T3.1(G)

Not connected (* = marked no-connect by the designer): D2 1(IO1)*; J5 3(COEX1)* 5(COEX2)* 8(UIM_PWR)* 10(UIM_DATA)* 12(UIM_CLOCK)* 14(UIM_RESET)* 16(UIM_VPP)* 17(SIM_C8/RSVD)* 19(SIM_C4/RSVD)* 30(SMB_CLK)* 32(SMB_DAT)* 42(LED_WWAN#)* 44(LED_WLAN#)* 45(RSVD)* 46(LED_WPAN#)* 47(RSVD)* 49(RSVD)* 51(RSVD)*

### Layout directives
differential pair: PEX/SATA_TX_N, PEX/SATA_TX_P, PEX_CLK_N, PEX_CLK_P, PEX_RX/SATA_RX_N, PEX_RX/SATA_RX_P, PEX_RX_MOD_N, PEX_RX_MOD_P, PEX_RX_N, PEX_RX_P, PEX_TX_MOD_N, PEX_TX_MOD_P, PEX_TX_N, PEX_TX_P, SATA_RX_MOD_N, SATA_RX_MOD_P, SATA_RX_N, SATA_RX_P, SATA_TX_MOD_N, SATA_TX_MOD_P, SATA_TX_N, SATA_TX_P, USB0_D_N, USB0_D_P, USB0_DP_N, USB0_DP_P, USB1_D_L_N, USB1_D_L_P, USB1_D_N, USB1_D_P, USB2_D_N, USB2_D_P, USB2_DL_N, USB2_DL_P, USB3_RX_L_N, USB3_RX_L_P, USB3_RX_N, USB3_RX_P, USB3_TX_L_N, USB3_TX_L_P, USB3_TX_N, USB3_TX_P
net class Zd_100Ohm: GND, PEX/SATA_TX_N, PEX/SATA_TX_P, PEX_CLK_N, PEX_CLK_P, PEX_RX/SATA_RX_N, PEX_RX/SATA_RX_P, PEX_RX_MOD_N, PEX_RX_MOD_P, PEX_RX_N, PEX_RX_P, PEX_TX_MOD_N, PEX_TX_MOD_P, PEX_TX_N, PEX_TX_P, SATA_RX_MOD_N, SATA_RX_MOD_P, SATA_RX_N, SATA_RX_P, SATA_SEL, SATA_TX_MOD_N, SATA_TX_MOD_P, SATA_TX_N, SATA_TX_P
net class Zd_90Ohm: GND, SHIELD_USB, USB0_D_N, USB0_D_P, USB0_DP_N, USB0_DP_P, USB0_ID, USB1_D_L_N, USB1_D_L_P, USB1_D_N, USB1_D_P, USB2_D_N, USB2_D_P, USB2_DL_N, USB2_DL_P, USB3_RX_L_N, USB3_RX_L_P, USB3_RX_N, USB3_RX_P, USB3_TX_L_N, USB3_TX_L_P, USB3_TX_N, USB3_TX_P, VCC_USB

### Notes on the sheet
- USB Load Switch
- USB OTG
- (near R33) DNP
- (near LED2) USB_PW
- (near R27) Current limit set to 1.4A
- USB 3.0 Connector
- PCI-E Connector
- DEBUG LED
- MiniPCI / SATA MUX
- SATA is the default option
- (near R12) DNP
- (near IC13) SEL LOW A->B
- (near IC13) SEL HIGH A->C
- Title:
- Size:
- Date:
- A3
- Revision:
- Page:
- of
- Antmicro Ltd.
- File:
- www.antmicro.com
- (in symbol CON-Molex-67910-5700) Mini PCIe
- (in symbol MECH-Molex-48099-5701) Mini PCIe Latch
- (in symbol WE_692121430000) USB 3.0

### Library data of the parts
C14 C36-C39 = C_10u_0603: as C52 on sheet Misc; Value: 10u; Part Number: C_10u_0603
C19-C22 C24 C25 C49 C50 = C_100n_0402: as C53 on sheet HDMI; Value: 100n; Part Number: C_100n_0402
C33 = C_100u_KEMET_A: Tantalum SMT Capacitor 100uF Case KEMET_A; Manufacturer: VISHAY; Part Symbol: 298D107X06R3A2T; Value: 100u; Part Number: C_100u_KEMET_A
C34 = C_1u_0603: as C42 on sheet Misc; Value: 1u; Part Number: C_1u_0603
C46-C48 = C_10n_0603: as C6 on sheet Supply; Value: 10n; Part Number: C_10n_0603
D1 D2 = TPD2E009: as D18 on sheet UART; Part Number: TPD2E009DRTR; Value: TPD2E009DRTR; Part Symbol: TPD2E009DRTR
D8 = TPD6E05U06_PASS: ESD Suppressors 6-CH Pass through layout; Manufacturer: Texas Instruments; Part Symbol: TPD6E05U06RVZR; Part Number: TPD6E05U06_PASS; Value: TPD6E05U06
GP19 = LED_G: as 5V on sheet Supply; Part Number: LED_G; Value: KPT-1608SGC; Part Symbol: KPT-1608SGC
IC10 = NCP380HSNAJAAT1G: POWER LOAD SWITCH, HIGH SIDE; Manufacturer: ON Semiconductor; Part Number: NCP380HSNAJAAT1G; Value: NCP380HSNAJAAT1G; Part Symbol: NCP380HSNAJAAT1G
IC13 = CBTL02042A: IC MUX/DEMUX 2:1 PCI 20DHVQFN; Manufacturer: NXP Semiconductors; Part Symbol: CBTL02042ABQ,115; Part Number: CBTL02042ABQ; Value: CBTL02042ABQ
J4 = WE_692121430000: WURTH ELEKTRONIK 	692121430000  USB Connector, USB Type A, USB 3.0, Receptacle, 9 Ways, PCB Mount, Vertical; Part Number: WE_692121430000; Value: WE_692121430000; Manufacturer: WURTH ELEKTRONIK; Part Symbol: 692121430000
J5 = CON-Molex-67910-5700: PCIe Mini Card Holder 4mm; Manufacturer: Molex; Part Number: CON-Molex-67910-5700; Value: Molex_67910-5700; Part Symbol: 67910-5700
L5 L9-L11 L13 = DLW21SN900SQ2: Common mode choke; Manufacturer: MURATA; Part Symbol: DLW21SN900SQ2L; Part Number: DLW21SN900SQ2; Value: DLW21SN900SQ2
L6 = BLM18EG221SN1D: MURATA 	BLM18EG221SN1D  FERRITE BEAD, 0.05OHM, 2A, 0603; Part Number: BLM18EG221SN1D; Value: BLM18EG221SN1D; Manufacturer: MURATA; Part Symbol: BLM18EG221SN1D
L7 L12 = BLM18PG330SN1D: MURATA 	BLM18PG330SN1D  FERRITE BEAD, 0.025OHM, 3A, 0603; Part Number: BLM18PG330SN1D; Value: BLM18PG330SN1D; Manufacturer: MURATA; Part Symbol: BLM18PG330SN1D
LED2 = LED_R: LED Red 0603 case; Part Number: LED_R; Manufacturer: KINGBRIGHT; Value: KPT-1608EC; Part Symbol: KPT-1608EC
PCI/SATA = LED_G: LED Green 0603 case; Part Number: LED_G; Manufacturer: KINGBRIGHT; Value: KPT-1608SGC; Part Symbol: KPT-1608SGC
PCIE = MECH-Molex-48099-5701: PCI Express/PCI Connectors LATCH ASSY FOR MINIP CI-ENEW TYPE W/COVER; Manufacturer: Molex; Part Number: MECH-Molex-48099-5701; Value: MECH-Molex-48099-5701; Part Symbol: 48099-5701
R12 R33 R37 R44 = R_0R_0603: as R71 on sheet ID-Serial; Part Number: R_0R_0603; Value: 0R
R13 = R_47k_0603: SMT Resistor 47k 0603; Manufacturer: MULTICOMP; Part Symbol: MCWR06X4702FTL; Value: 47k; Part Number: R_47k_0603
R18 = R_470R_0603: as R6 on sheet Supply; Value: 470R; Part Number: R_470R_0603
R27 = R_13k_0603: SMT Resistor 13k 0603; Manufacturer: PANASONIC ELECTRONIC COMPONENTS; Part Symbol: ERJ3GEYJ133V; Value: 13k; Part Number: R_13k_0603
R29 = R_22R_0603: as R40 on sheet UART; Value: 22R; Part Number: R_22R_0603
R31 R35 = R_330R_0603: SMT Resistor 330R 0603; Manufacturer: BOURNS; Part Symbol: CR0603-FX-3300GLF; Part Number: R_330R_0603; Value: 330R
R32 R36 R39 = R_10k_0603: as R9 on sheet HDMI; Value: 10k; Part Number: R_10k_0603
T3 T4 = PMV16XN: as T5 on sheet Misc; Value: PMV16XN; Part Number: PMV16XN; Part Symbol: PMV16XN
TP12 TP13 = TP-R-2: Testpad, round, 2mm; Part Number: TP-R-2
X2 = Micro USB A/B TH Vert: as X1 on sheet UART; Part Number: Micro USB A/B TH Vert; Value: USB3106-30-0230-A